# Altium project Video_Processing_Board.PrjPcb (part 1 of 2)
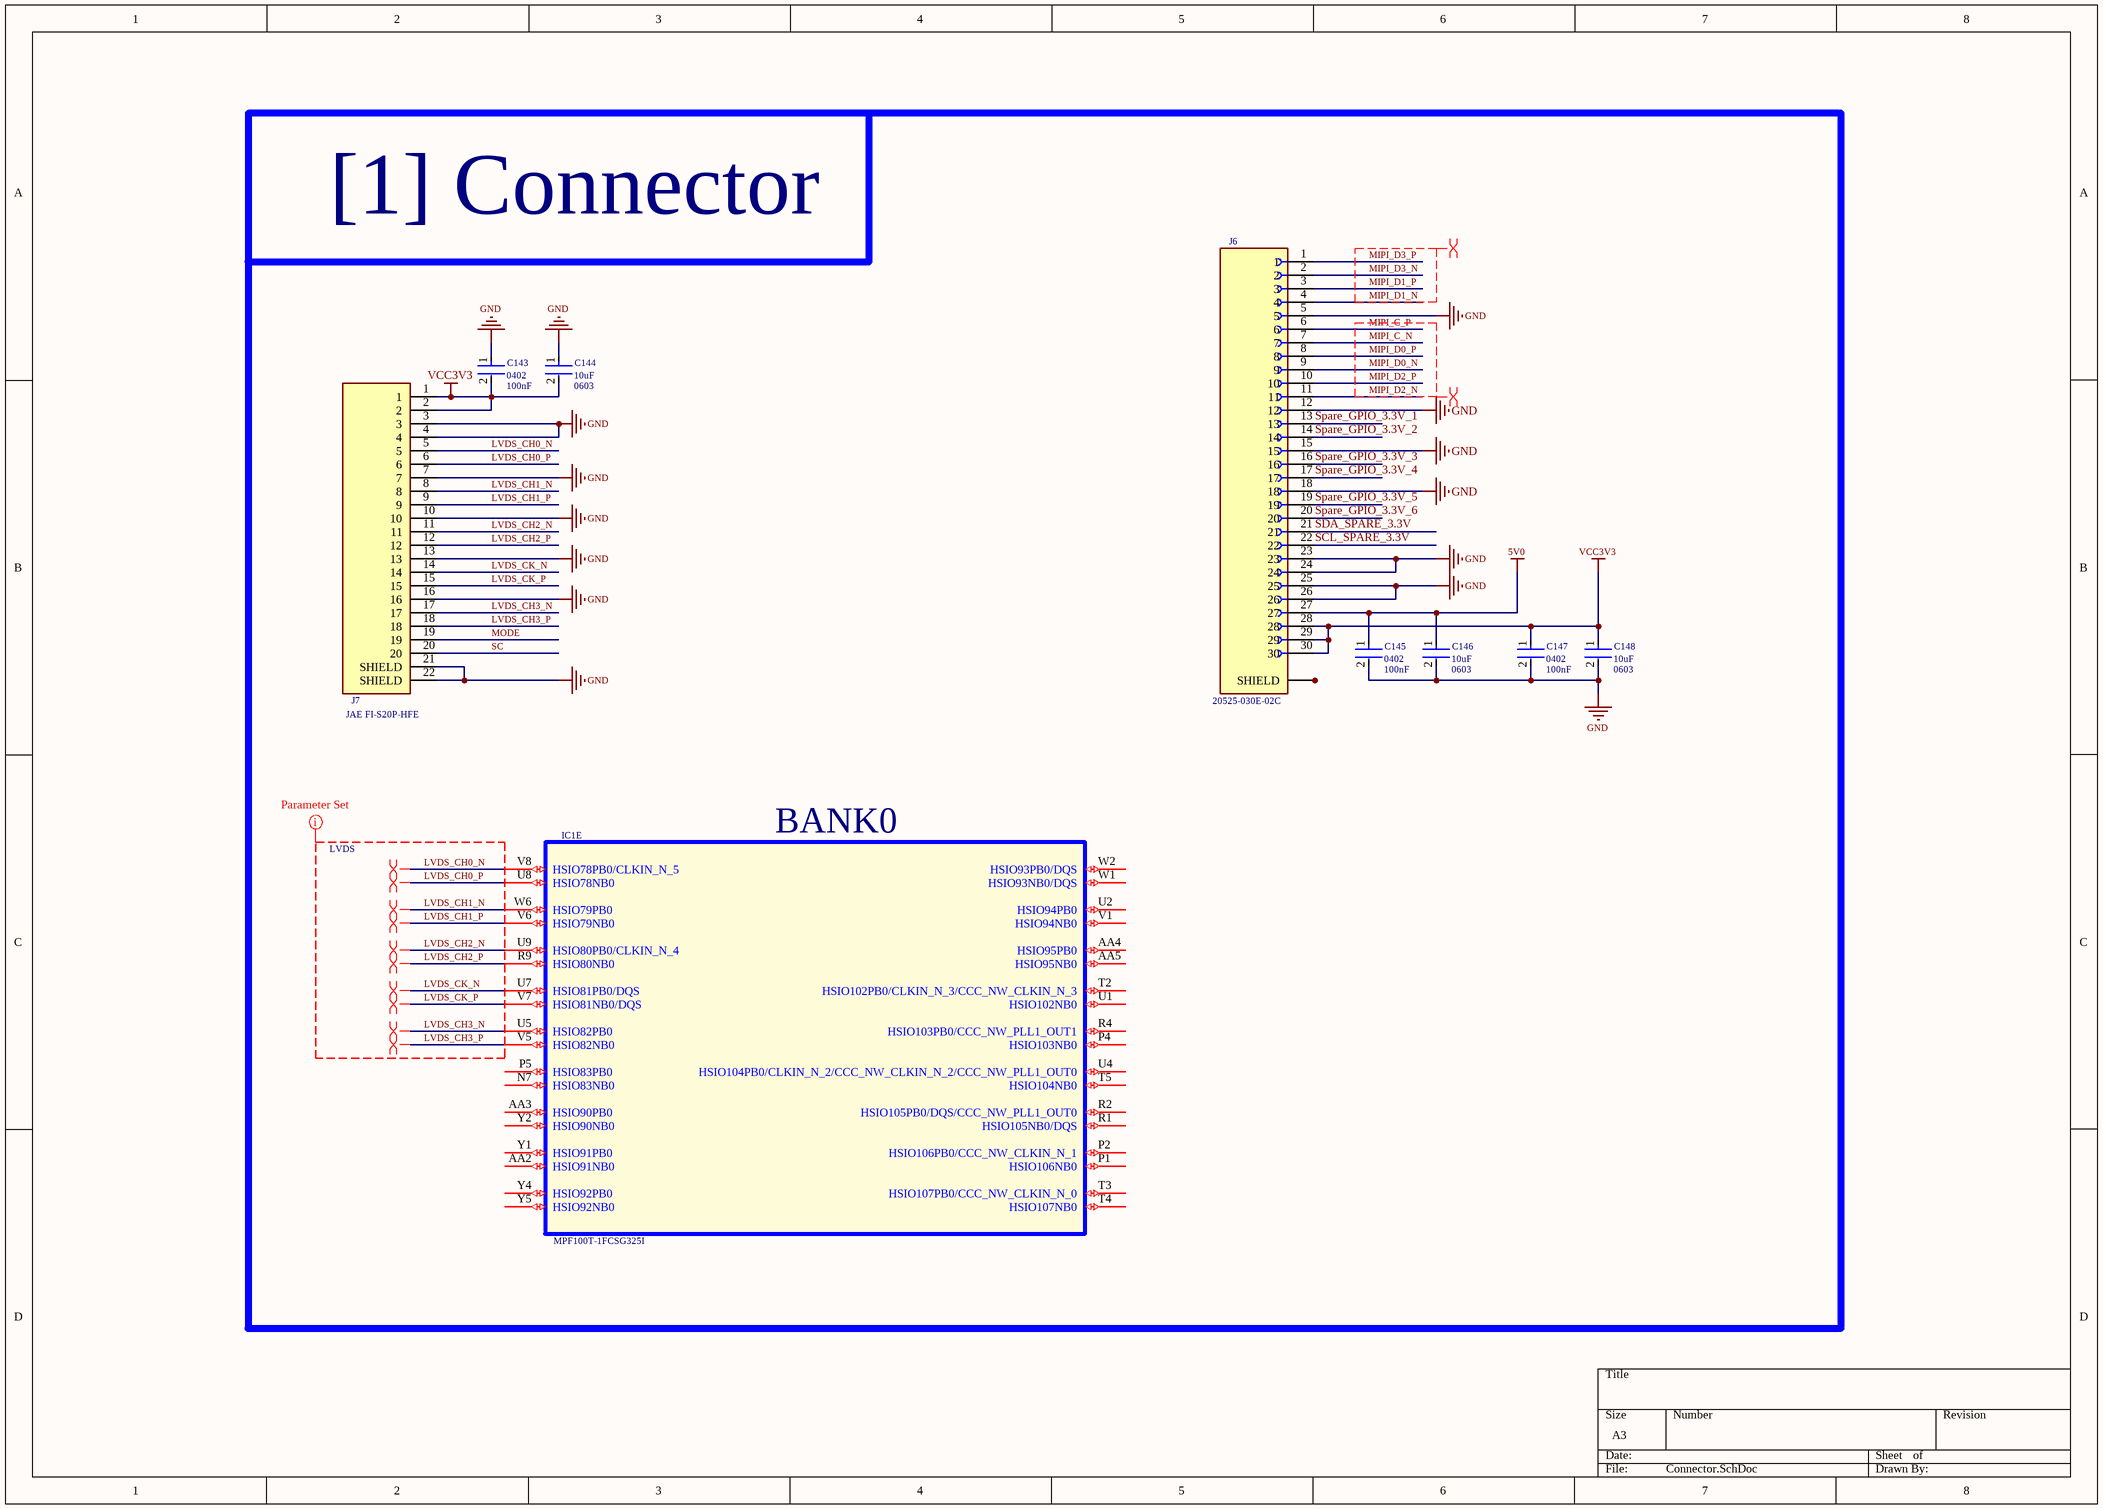
[diagram p0: Connector.SchDoc]
9 sheets, 308 parts. Net scope: global (net labels, ports and power ports of the same name join across sheets).
Board file: Video_Processing_Board.PcbDoc
Sheets:
  Connector.SchDoc
  PMIC.SchDoc
  Power and Decoupling Capacitors.SchDoc
  DRAM+BANK1.SchDoc
  Input Transceivers.SchDoc
  Output Transceivers.SchDoc
  JTAG & Reset Connection.SchDoc
  USBModule.SchDoc
  FPGA_BANKS.SchDoc

## Sheet Connector.SchDoc
size A3; SheetNumber: 1; SheetTotal: 9

### Parts
C143  Package: 0402  Capacitance: 100nF  [FP-C0402-BB-MFG]  (hidden comment: C0402C104K8PACTU)
C144  Capacitance: 10uF  Case/Package: 0603  [FP-GRM188-0_1-e0_2_0_55-IPC_A]  (hidden comment: GRM188R60J106ME47D)
C145  Package: 0402  Capacitance: 100nF  [FP-C0402-BB-MFG]  (hidden comment: C0402C104K8PACTU)
C146  Capacitance: 10uF  Case/Package: 0603  [FP-GRM188-0_1-e0_2_0_55-IPC_A]  (hidden comment: GRM188R60J106ME47D)
C147  Package: 0402  Capacitance: 100nF  [FP-C0402-BB-MFG]  (hidden comment: C0402C104K8PACTU)
C148  Capacitance: 10uF  Case/Package: 0603  [FP-GRM188-0_1-e0_2_0_55-IPC_A]  (hidden comment: GRM188R60J106ME47D)
IC1  MPF100T-1FCSG325I  [MPF100T-1FCSG325I]  (part E of 9)
J6  20525-030E-02C  [I-PEX_20525-030E-02C]
J7  JAE FI-S20P-HFE  [JAE FI-S20P-HFE]

### Blocks framed on the sheet
[1] Connector: C143-C148 IC1 J6 J7

### Nets
5V0: C145.1 C146.1 J6.27
GND: C143.1 C144.1 C145.2 C146.2 C147.2 C148.2 J6.5 J6.12 J6.15 J6.18 J6.23 J6.24 J6.25 J6.26 J7.3 J7.4 J7.7 J7.10 J7.13 J7.16 J7.21(SHIELD) J7.22(SHIELD)
VCC3V3: C143.2 C144.2 C147.1 C148.1 J6.28 J6.29 J6.30 J7.1 J7.2
LVDS_CH0_N: IC1.V8(HSIO78PB0/CLKIN_N_5) J7.5
LVDS_CH0_P: IC1.U8(HSIO78NB0) J7.6
LVDS_CH1_N: IC1.W6(HSIO79PB0) J7.8
LVDS_CH1_P: IC1.V6(HSIO79NB0) J7.9
LVDS_CH2_N: IC1.U9(HSIO80PB0/CLKIN_N_4) J7.11
LVDS_CH2_P: IC1.R9(HSIO80NB0) J7.12
LVDS_CH3_N: IC1.U5(HSIO82PB0) J7.17
LVDS_CH3_P: IC1.V5(HSIO82NB0) J7.18
LVDS_CK_N: IC1.U7(HSIO81PB0/DQS) J7.14
LVDS_CK_P: IC1.V7(HSIO81NB0/DQS) J7.15
MIPI_C_N: J6.7
MIPI_C_P: J6.6
MIPI_D0_N: J6.9
MIPI_D0_P: J6.8
MIPI_D1_N: J6.4
MIPI_D1_P: J6.3
MIPI_D2_N: J6.11
MIPI_D2_P: J6.10
MIPI_D3_N: J6.2
MIPI_D3_P: J6.1
MODE: J7.19
SC: J7.20
SCL_SPARE_3.3V: J6.22
SDA_SPARE_3.3V: J6.21
Spare_GPIO_3.3V_1: J6.13
Spare_GPIO_3.3V_2: J6.14
Spare_GPIO_3.3V_3: J6.16
Spare_GPIO_3.3V_4: J6.17
Spare_GPIO_3.3V_5: J6.19
Spare_GPIO_3.3V_6: J6.20
NetJ6_P1: J6.P1(SHIELD) J6.P2(SHIELD) J6.P3(SHIELD) J6.P4(SHIELD) J6.P5(SHIELD) J6.P6(SHIELD) J6.P7(SHIELD) J6.P8(SHIELD) J6.P9(SHIELD) J6.P10(SHIELD) J6.P11(SHIELD)

Not connected (* = marked no-connect by the designer): IC1 AA2(HSIO91NB0) AA3(HSIO90PB0) AA4(HSIO95PB0) AA5(HSIO95NB0) N7(HSIO83NB0) P1(HSIO106NB0) P2(HSIO106PB0/CCC_NW_CLKIN_N_1) P4(HSIO103NB0) P5(HSIO83PB0) R1(HSIO105NB0/DQS) R2(HSIO105PB0/DQS/CCC_NW_PLL1_OUT0) R4(HSIO103PB0/CCC_NW_PLL1_OUT1) T2(HSIO102PB0/CLKIN_N_3/CCC_NW_CLKIN_N_3) T3(HSIO107PB0/CCC_NW_CLKIN_N_0) T4(HSIO107NB0) T5(HSIO104NB0) U1(HSIO102NB0) U2(HSIO94PB0) U4(HSIO104PB0/CLKIN_N_2/CCC_NW_CLKIN_N_2/CCC_NW_PLL1_OUT0) V1(HSIO94NB0) W1(HSIO93NB0/DQS) W2(HSIO93PB0/DQS) Y1(HSIO91PB0) Y2(HSIO90NB0) Y4(HSIO92PB0) Y5(HSIO92NB0)

### Layout directives
differential pair: LVDS_CH0_N, LVDS_CH0_P, LVDS_CH1_N, LVDS_CH1_P, LVDS_CH2_N, LVDS_CH2_P, LVDS_CH3_N, LVDS_CH3_P, LVDS_CK_N, LVDS_CK_P, MIPI_C_N, MIPI_C_P, MIPI_D0_N, MIPI_D0_P, MIPI_D1_N, MIPI_D1_P, MIPI_D2_N, MIPI_D2_P, MIPI_D3_N, MIPI_D3_P
net class LVDS: LVDS_CH0_N, LVDS_CH0_P, LVDS_CH1_N, LVDS_CH1_P, LVDS_CH2_N, LVDS_CH2_P, LVDS_CH3_N, LVDS_CH3_P, LVDS_CK_N, LVDS_CK_P

### Notes on the sheet
- (in symbol MPF100T-1FCSG325I, part E) BANK0

### Library data of the parts
C143 C145 C147 = CMP-2008-02046-2: CAP CER 0.1UF 10V X5R 0402; Manufacturer: Kemet; Material: Ceramic; Temperature Coefficient: 15%; Tolerance: 0.1; Value: 0.10 μF; Temperature: -55°C to +125°C; ComponentLink2Description: Datasheet; Temperature Characteristic: X5R; Device Class L1: Passive Components; Height: 0.55mm; Lead Free: Yes; ComponentLink2URL: https://content.kemet.com/datasheets/KEM_C1002_X7R_SMD.pdf; Device Class L2: Capacitors; Temperature Range Low: -55°C; Temperature Range High: +125°C; RoHS: TRUE; Octopart: https://octopart.com/c0402c104k8pactu-kemet-140039; Automotive: No; Mouser Description: Capacitor 100 nF 10 VDC 0402; Category: Cap; Voltage Rating: 10 V; Digikey Description: CAP CER 0.1UF 10V X5R 0402; Ipc Land Pattern Name: CAPC10050X50; Device Class L3: Ceramic Capacitors; Manufacturer Part Number: C0402C104K8PACTU; Manufacturer: KEMET
C144 C146 C148 = CMP-2006-02792-2: Chip Multilayer Ceramic Capacitors for General Purpose, 0603, 10uF, X5R, 15%, 20%, 6.3V; Manufacturer: Murata; Packaging: Tape and Reel; Voltage Rating (DC): 6.3V; Width: 0.031inch; Termination: SMD/SMT; Dielectric: X5R; Package Quantity: 4000; Voltage Rating: 6.3V; Min Operating Temperature: -55°C; Voltage: 6.3V; Length: 1.6mm; Thickness: 0.035inch; Lead Free: Lead Free; Depth: 0.8mm; Case Code (Imperial): 0603; Max Operating Temperature: 85°C; Material: Ceramic; Height: 0.8mm; Tolerance: 20%; Mount: Surface Mount; REACH SVHC: No SVHC; Radiation Hardening: No; Case Code (Metric): 1608; Manufacturer Part Number: GRM188R60J106ME47D
IC1 = MPF100T-1FCSG325I: Part_Number: J00001; Part_Name: Jumper; ID: 110; Mounting_Type: SMT; ComponentLink1Description: Datasheet
J6 = 20525-030E-02C: 0.4 mm pitch, Horizontal mating Micro-coaxial cable connector; MF: I-PEX; SnapEDA_Link: https://www.snapeda.com/parts/20525-030E-02C/I-PEX/view-part/?ref=snap; Availability: Not in stock; Package: Package; Check_prices: https://www.snapeda.com/parts/20525-030E-02C/I-PEX/view-part/?ref=eda; Value: *; Price: None; MP: 20525-030E-02C
J7 = JAE FI-S20P-HFE: Board-to-Cable Connector, Friction lock, connector, Standard type , 20 pos., 1.25mm pitch, Board side receptacle; Part_Number: J00001; Part_Name: Jumper; ID: 110; Mounting_Type: SMT; ComponentLink1Description: Datasheet

## Sheet PMIC.SchDoc
size A3; SheetNumber: 2; SheetTotal: 9; SPICEModelCacheDPLPYRRR: <root> / <DocumentId>DPLPYRRR</DocumentId> / <CacheFrame Number="0"> / <Model Name="emk105bj105_v-f" Kind="CKT"> / <Text>* EMK105BJ105_V-F     SPICE MODEL  ( General Type ) / *-------------------------------------------------------------------------------------------------------- / * Model Generated by TAIYO YUDEN Corporation (http://www.ty-top.com) / * Version 1.0 / * TAIYO YUDEN Control No. 170508_130520 / * Copyright(c) 2012 TAIYO YUDEN CO.,LTD. All Rights Reserved. / *-------------------------------------------------------------------------------------------------------- / * / * Products Name : Multilayer Ceramic Capacitors / * / * Characteristics : / *     Capacitance : 1 uF , Rated Voltage : 16V , TCC : X5R / *     Case Size : 1.0 x 0.5 / 0.039 x 0.02 [mm/inch] , Thickness : 0.5 / 0.02 [mm/inch] / *     (Conditions: Temperature = 25 degC , DC Bias Current/Voltage = 0A / 0V) / * / * Frequency Range : 40Hz - 3GHz / * / * External Node Assignments : / * / *  1  o---| |---o  2 / * / *-------------------------------------------------------------------------------------------------------- / .SubCkt EMK105BJ105_V-F 1 2 / **************************** / C0 1 110 0.68309u / Cm 1 101 0.26053u / C1 101 102 0.94076u / Rc1 101 102 1.9029k / C2 102 103 0.66707u / Rc2 102 103 120.36 / C3 103 110 0.57203u / Rc3 103 110 2.1097 / C2m 1 301 0.1871u / C21 301 302 3.2494u / Rc21 301 302 1.1117k / C22 302 303 2.1014u / Rc22 302 303 1.484k / C23 303 304 2.1172u / Rc23 303 304 1.3876k / C24 304 305 0.75729u / Rc24 304 305 332.59 / C25 305 306 0.94401u / Rc25 305 306 249.09 / C26 306 307 0.34674u / Rc26 306 307 28.352 / C27 307 308 0.37158u / Rc27 307 308 19.989 / C28 308 309 0.17933u / Rc28 308 309 31.748 / C29 309 110 0.016445u / Rc29 309 110 1.0592 / Rp0 1 110 100Meg / L0 110 120 0.2216n / Lm 120 130 0.1509n / L1 120 121 0.12659n / RL1 121 130 0.85161 / L2 120 122 0.15996n / RL2 122 130 0.42469 / L3 120 123 7.9543n / RL3 123 130 0.54643m / CR 120 124 0.24334u / LR 124 125 0.090738n / RR 125 130 68.076m / CL 130 140 2.7354p / LL 130 140 0.10762n / RL 130 140 50.614 / Rs 140 2 7.5416m / **************************** / .ends EMK105BJ105_V-F</Text> / </Model> / </CacheFrame> / </root>
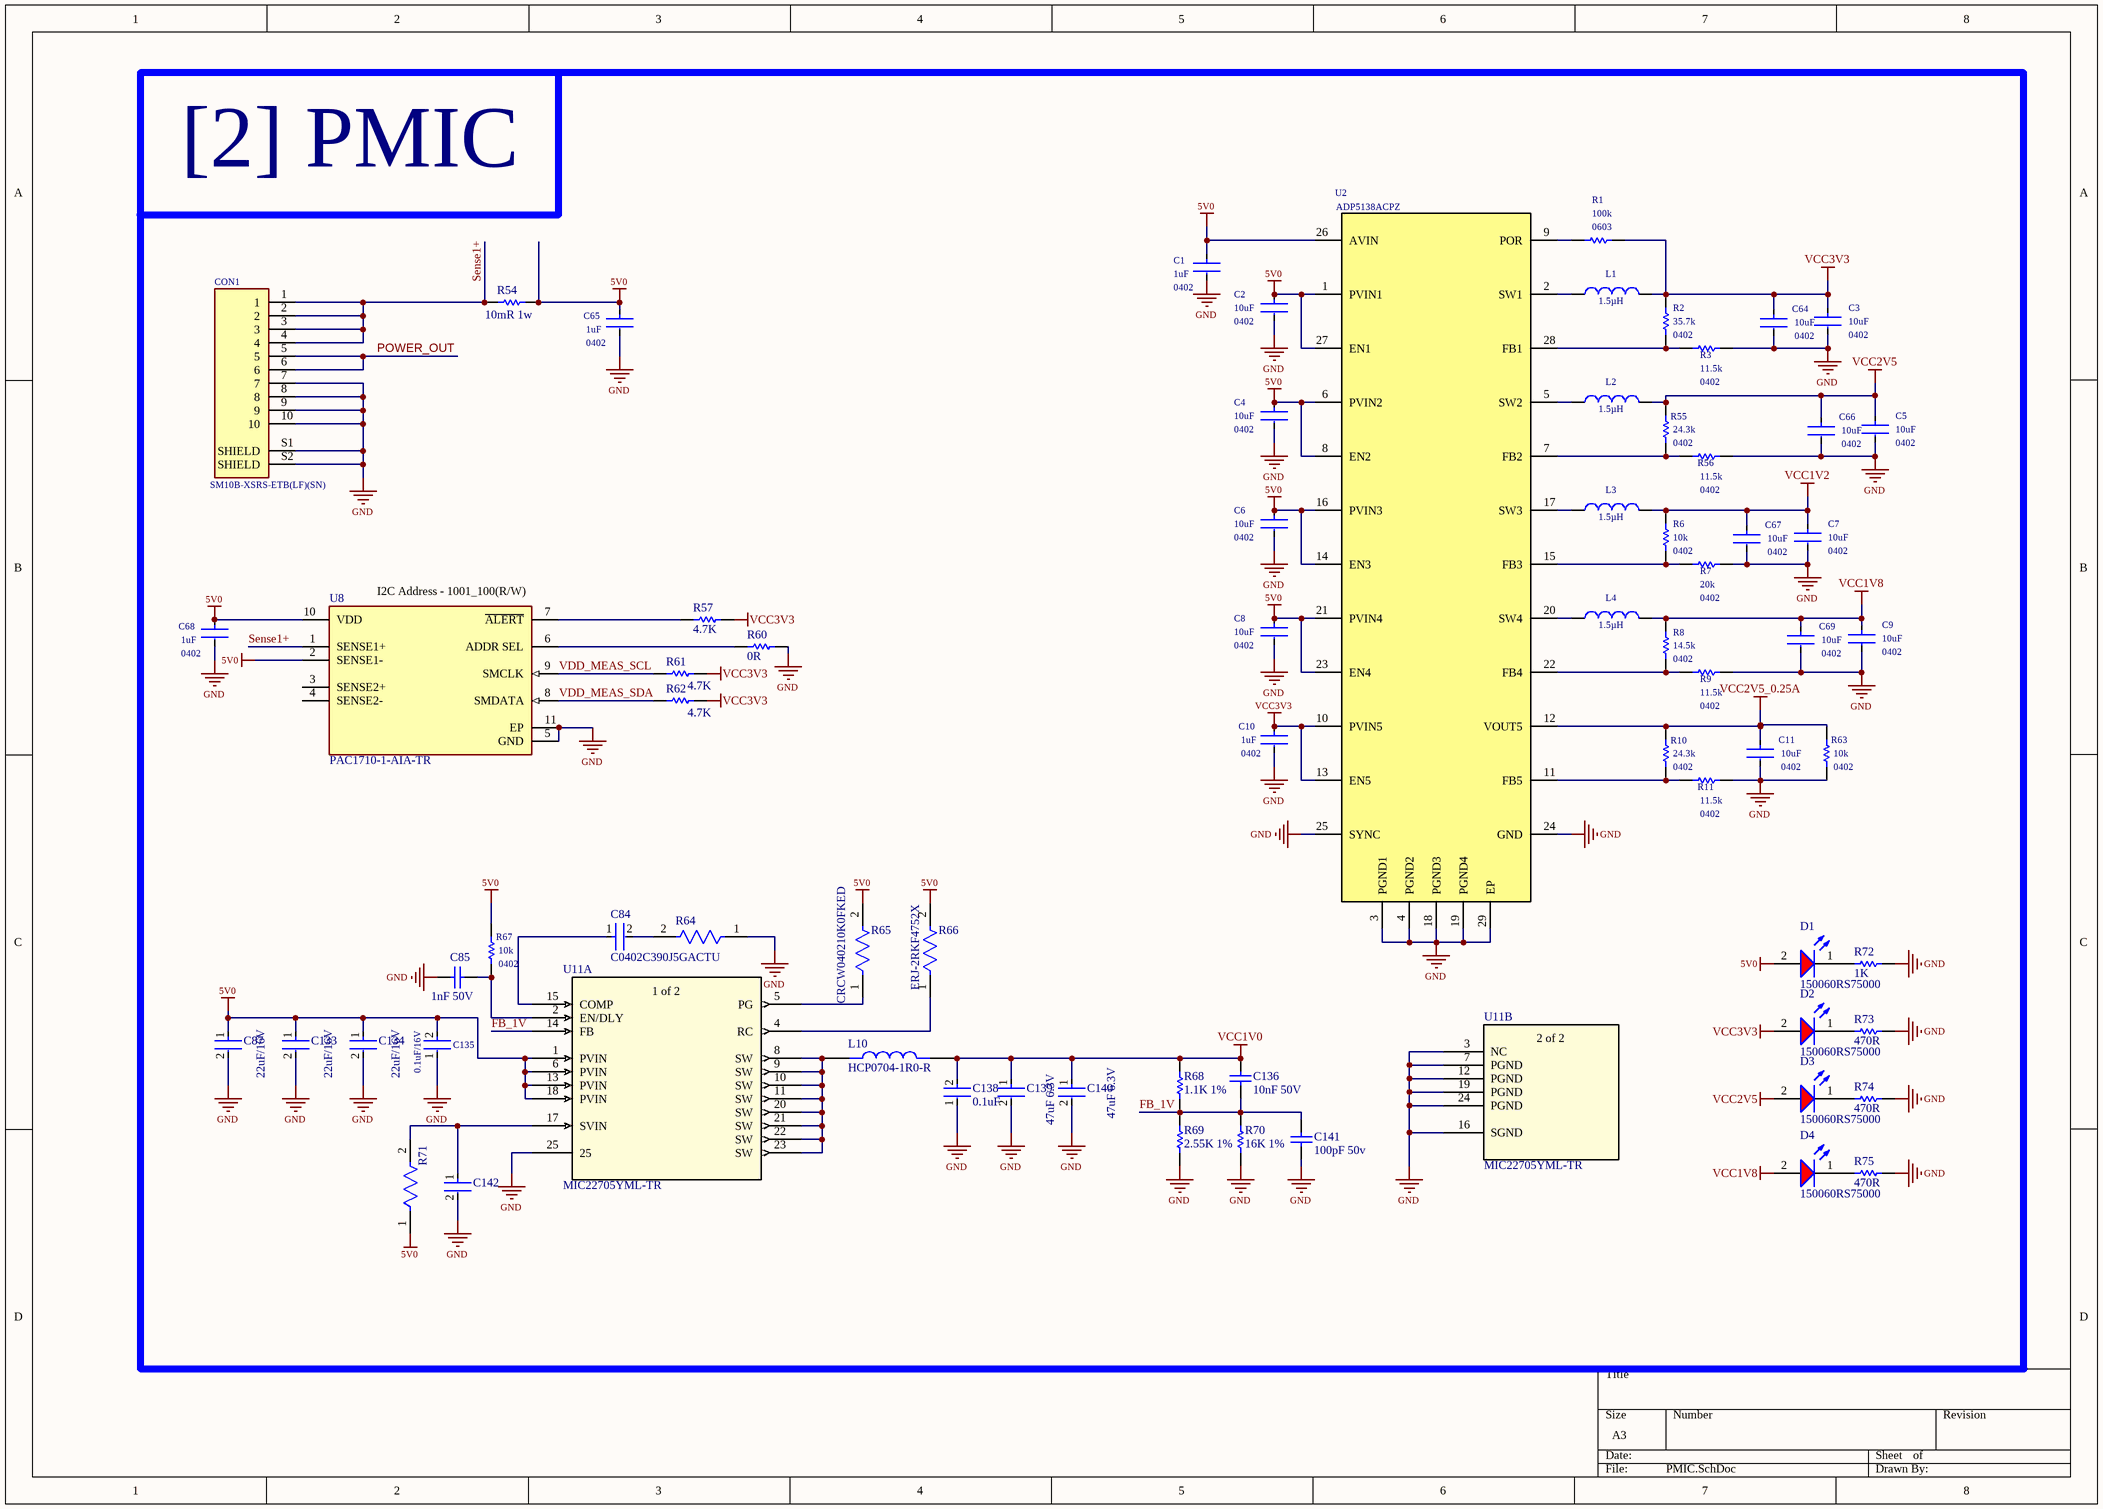
[diagram p1: PMIC.SchDoc]

### Parts
C1  Case/Package: 0402  Capacitance: 1uF  [FP-0402-L_1_0_0_05-W_0_5-IPC_A]  (hidden comment: EMK105BJ105KV-F)
C2  Case/Package: 0402  Capacitance: 10uF  [FP-GRM155-0_2-IPC_B]  (hidden comment: GRM155R60J106ME44D)
C3  Case/Package: 0402  Capacitance: 10uF  [FP-GRM155-0_2-IPC_B]  (hidden comment: GRM155R60J106ME44D)
C4  Case/Package: 0402  Capacitance: 10uF  [FP-GRM155-0_2-IPC_B]  (hidden comment: GRM155R60J106ME44D)
C5  Case/Package: 0402  Capacitance: 10uF  [FP-GRM155-0_2-IPC_B]  (hidden comment: GRM155R60J106ME44D)
C6  Case/Package: 0402  Capacitance: 10uF  [FP-GRM155-0_2-IPC_B]  (hidden comment: GRM155R60J106ME44D)
C7  Case/Package: 0402  Capacitance: 10uF  [FP-GRM155-0_2-IPC_B]  (hidden comment: GRM155R60J106ME44D)
C8  Case/Package: 0402  Capacitance: 10uF  [FP-GRM155-0_2-IPC_B]  (hidden comment: GRM155R60J106ME44D)
C9  Case/Package: 0402  Capacitance: 10uF  [FP-GRM155-0_2-IPC_B]  (hidden comment: GRM155R60J106ME44D)
C10  Case/Package: 0402  Capacitance: 1uF  [FP-0402-L_1_0_0_05-W_0_5-IPC_A]  (hidden comment: EMK105BJ105KV-F)
C11  Case/Package: 0402  Capacitance: 10uF  [FP-GRM155-0_2-IPC_B]  (hidden comment: GRM155R60J106ME44D)
C64  Case/Package: 0402  Capacitance: 10uF  [FP-GRM155-0_2-IPC_B]  (hidden comment: GRM155R60J106ME44D)
C65  Case/Package: 0402  Capacitance: 1uF  [FP-0402-L_1_0_0_05-W_0_5-IPC_A]  (hidden comment: EMK105BJ105KV-F)
C66  Case/Package: 0402  Capacitance: 10uF  [FP-GRM155-0_2-IPC_B]  (hidden comment: GRM155R60J106ME44D)
C67  Case/Package: 0402  Capacitance: 10uF  [FP-GRM155-0_2-IPC_B]  (hidden comment: GRM155R60J106ME44D)
C68  Case/Package: 0402  Capacitance: 1uF  [FP-0402-L_1_0_0_05-W_0_5-IPC_A]  (hidden comment: EMK105BJ105KV-F)
C69  Case/Package: 0402  Capacitance: 10uF  [FP-GRM155-0_2-IPC_B]  (hidden comment: GRM155R60J106ME44D)
C84  C0402C390J5GACTU  [FP-C0402-BB-MFG]
C85  1nF 50V  [CAPC1005X55X25ML5T10]
C87  22uF/16V  [FP-0805-L_2_0_0_2-W_1_25-IPC_A]
C133  22uF/16V  [FP-0805-L_2_0_0_2-W_1_25-IPC_A]
C134  22uF/16V  [FP-0805-L_2_0_0_2-W_1_25-IPC_A]
C135  0.1uF/16V  [FP-GRM15-MFG]
C136  10nF 50V  [CAPC1005X55X30LL05T10]
C138  0.1uF  [FP-GRM15-MFG]
C139  47uF 6.3V  [FP-C0805C476M9PACTU-MFG]
C140  47uF 6.3V  [FP-C0805C476M9PACTU-MFG]
C141  100pF 50v  [CAPC1005X55X25ML05T10]
C142  C1005X5R1C225K050BC  [FP-C1005-050-0_05-IPC_A]  (value not drawn)
CON1  SM10B-XSRS-ETB(LF)(SN)  [SM10B-XSRS-ETB]
D1  150060RS75000  [WL-SMCW_0603_150060xx75000]
D2  150060RS75000  [WL-SMCW_0603_150060xx75000]
D3  150060RS75000  [WL-SMCW_0603_150060xx75000]
D4  150060RS75000  [WL-SMCW_0603_150060xx75000]
L1  Inductance: 1.5µH  [WE-TPC-3816-S]  (hidden comment: 744031001)
L2  Inductance: 1.5µH  [WE-TPC-3816-S]  (hidden comment: 744031001)
L3  Inductance: 1.5µH  [WE-TPC-3816-S]  (hidden comment: 744031001)
L4  Inductance: 1.5µH  [WE-TPC-3816-S]  (hidden comment: 744031001)
L10  HCP0704-1R0-R  [IND_SCIHP1367-100M]
R1  value 100k  Package: 0603  [RESC1608X55X30ML20T20]  (hidden comment: ERA3AEB104V)
R2  Parameter 1: 35.7k  Parameter 2: 0402  [RESC1005X40X25NL05T10]  (hidden comment: RC0402FR-0735K7L)
R3  Parameter 3: 11.5k  Parameter 4: 0402  [RESC1005X40X25NL05T10]  (hidden comment: RC0402FR-0711K5L)
R6  Parameter 3: 10k  Parameter 4: 0402  [RESC1005X40X25NL05T10]  (hidden comment: RC0402FR-0710KL)
R7  Parameter 3: 20k  Parameter 4: 0402  [RESC1005X40X25NL05T10]  (hidden comment: RC0402FR-0720KL)
R8  Parameter 3: 14.5k  Parameter 4: 0402  [RESC1005X40N]  (hidden comment: RN73H1ETTP1452F25)
R9  Parameter 3: 11.5k  Parameter 4: 0402  [RESC1005X40X25NL05T10]  (hidden comment: RC0402FR-0711K5L)
R10  Parameter 3: 24.3k  Parameter 4: 0402  [RESC1005X40X25NL05T10]  (hidden comment: RC0402FR-0724K3L)
R11  Parameter 3: 11.5k  Parameter 4: 0402  [RESC1005X40X25NL05T10]  (hidden comment: RC0402FR-0711K5L)
R54  10mR 1w  [RESC2013X50X30LL20T20]
R55  Parameter 3: 24.3k  Parameter 4: 0402  [RESC1005X40X25NL05T10]  (hidden comment: RC0402FR-0724K3L)
R56  Parameter 3: 11.5k  Parameter 4: 0402  [RESC1005X40X25NL05T10]  (hidden comment: RC0402FR-0711K5L)
R57  4.7K  [RESC1005X40X25LL05T05]
R60  0R  [RESC1608X55X25ML10T15]
R61  4.7K  [RESC1005X40X25LL05T05]
R62  4.7K  [RESC1005X40X25LL05T05]
R63  Parameter 3: 10k  Parameter 4: 0402  [RESC1005X40X25NL05T10]  (hidden comment: RC0402FR-0710KL)
R64  CRCW040220K0FKED  [FP-CRCW0402-e3-IPC_B]  (value not drawn)
R65  CRCW040210K0FKED  [FP-CRCW0402-e3-IPC_B]
R66  ERJ-2RKF4752X  [FP-ERJ2RK-IPC_A]
R67  Parameter 3: 10k  Parameter 4: 0402  [RESC1005X40X25NL05T10]  (hidden comment: RC0402FR-0710KL)
R68  1.1K 1%  [RESC0603X26X15ML03T05]
R69  2.55K 1%  [RESC2013X60X40NL20T25]
R70  16K 1%  [RESC1005X40X25ML05T10]
R71  CRCW04022R20FKED  [FP-CRCW0402-e3-IPC_C]  (value not drawn)
R72  1K  [RESC1005X40X25ML05T10]
R73  470R  [RESC1005X40X25ML05T10]
R74  470R  [RESC1005X40X25ML05T10]
R75  470R  [RESC1005X40X25ML05T10]
U2  ADP5138ACPZ  [CP_28_5]
U8  PAC1710-1-AIA-TR  [FP-C04-206-MFG]
U11  MIC22705YML-TR  [MLF-24_ML_MCH]  (parts A,B of 2)

### Nets
5V0: C1.1 C2.1 C4.1 C6.1 C8.1 C65.1 C68.1 C87.1 C133.1 C134.1 C135.2 D1.2(A) R54.2 R65.2 R66.2 R67.2 R71.1 U2.1(PVIN1) U2.6(PVIN2) U2.8(EN2) U2.14(EN3) U2.16(PVIN3) U2.21(PVIN4) U2.23(EN4) U2.26(AVIN) U2.27(EN1) U8.2(SENSE1-) U8.10(VDD) U11.1(PVIN) U11.6(PVIN) U11.13(PVIN) U11.18(PVIN)
GND: C1.2 C2.2 C3.2 C4.2 C5.2 C6.2 C7.2 C8.2 C9.2 C10.2 C11.2 C64.2 C65.2 C66.2 C67.2 C68.2 C69.2 C85.1 C87.2 C133.2 C134.2 C135.1 C138.1 C139.2 C140.2 C141.1 C142.2 CON1.7 CON1.8 CON1.9 CON1.10 CON1.S1(SHIELD) CON1.S2(SHIELD) R3.2 R7.2 R9.2 R11.2 R56.2 R60.2 R63.1 R64.1 R69.1 R70.1 R72.2 R73.2 R74.2 R75.2 U2.3(PGND1) U2.4(PGND2) U2.18(PGND3) U2.19(PGND4) U2.24(GND) U2.25(SYNC) U2.29(EP) U8.5(GND) U8.11(EP) U11.3(NC) U11.7(PGND) U11.12(PGND) U11.16(SGND) U11.19(PGND) U11.24(PGND) U11.25
VCC1V0: C136.2 C138.2 C139.1 C140.1 L10.2 R68.2
VCC1V2: C7.1 C67.1 L3.2 R6.2
VCC1V8: C9.1 C69.1 D4.2(A) L4.2 R8.2
VCC2V5: C5.1 C66.1 D3.2(A) L2.2 R55.2
VCC2V5_0.25A: C11.1 R10.2 R63.2 U2.12(VOUT5)
VCC3V3: C3.1 C10.1 C64.1 D2.2(A) L1.2 R1.2 R2.2 R57.2 R61.2 R62.2 U2.10(PVIN5) U2.13(EN5)
FB_1V: C136.1 C141.2 R68.1 R69.2 R70.2 U11.14(FB)
POWER_OUT: CON1.5 CON1.6
Sense1+: CON1.1 CON1.2 CON1.3 CON1.4 R54.1 U8.1(SENSE1+)
VDD_MEAS_SCL: R61.1 U8.9(SMCLK)
VDD_MEAS_SDA: R62.1 U8.8(SMDATA)
NetC84_1: C84.1 U11.15(COMP)
NetC84_2: C84.2 R64.2
NetC85_2: C85.2 R67.1 U11.2(EN/DLY)
NetC142_1: C142.1 R71.2 U11.17(SVIN)
NetD1_1: D1.1(K) R72.1
NetD2_1: D2.1(K) R73.1
NetD3_1: D3.1(K) R74.1
NetD4_1: D4.1(K) R75.1
NetL1_1: L1.1 U2.2(SW1)
NetL2_1: L2.1 U2.5(SW2)
NetL3_1: L3.1 U2.17(SW3)
NetL4_1: L4.1 U2.20(SW4)
NetL10_1: L10.1 U11.8(SW) U11.9(SW) U11.10(SW) U11.11(SW) U11.20(SW) U11.21(SW) U11.22(SW) U11.23(SW)
NetR1_1: R1.1 U2.9(POR)
NetR2_1: R2.1 R3.1 U2.28(FB1)
NetR6_1: R6.1 R7.1 U2.15(FB3)
NetR8_1: R8.1 R9.1 U2.22(FB4)
NetR10_1: R10.1 R11.1 U2.11(FB5)
NetR55_1: R55.1 R56.1 U2.7(FB2)
NetR57_1: R57.1 U8.7(~{ALERT})
NetR60_1: R60.1 U8.6(ADDR_SEL)
NetR65_1: R65.1 U11.5(PG)
NetR66_1: R66.1 U11.4(RC)

Not connected (* = marked no-connect by the designer): U8 3(SENSE2+) 4(SENSE2-)

### Notes on the sheet
- [2] PMIC
- (near U8) I2C Address - 1001_100(R/W)
- (in symbol MIC22705YML-TR, part A) 1 of 2
- (in symbol MIC22705YML-TR, part B) 2 of 2

### Library data of the parts
C1 C10 C65 C68 = CMP-14477-000104-2: None; Tolerance: 10%; Voltage Rating: 16V; Dielectric: X5R; Packaging: Tape and Reel; Depth: 0.5mm; Mount: Surface Mount; Thickness: 0.022inch; Package Quantity: 1; Min Operating Temperature: -55°C; Series: M; Voltage Rating (DC): 16V; Termination: SMD/SMT; Number of Pins: 2; Case Code (Imperial): 0402; Length: 1mm; Halogen Free: Halogen Free; Case Code (Metric): 1005; Width: 0.02inch; RoHS Compliant: Yes; Radiation Hardening: No; Max Operating Temperature: 85°C; Height: 0.5mm; Construction: Flat
C2-C9 C11 C64 C66 C67 C69 = CMP-2000-05265-2: CAP CER 10UF 6.3V X5R 0402; Tolerance: 20%; Voltage Rating: 6.3V; Voltage Rating (DC): 6.3V; Voltage: 6.3V; Case Code (Metric): 1005; REACH SVHC: No SVHC; Min Operating Temperature: -55°C; Height: 0.5mm; Dielectric: X5R; Depth: 0.5mm; Thickness: 0.022inch; Packaging: Tape and Reel; Length: 1mm; Mount: Surface Mount; Package Quantity: 10000; Lead Free: Lead Free; Termination: SMD/SMT; Max Operating Temperature: 85°C; Case Code (Imperial): 0402; Series: GRM; Width: 0.5mm; RoHS Compliant: Yes
C84 = CMP-2008-03289-2: CAP CER 39PF 50V C0G/NP0 0402; Manufacturer: Kemet; Temperature Coefficient: 15%; Material: Ceramic; Tolerance: 0.05; Temperature Characteristic: C0G; Temperature: -55°C to +125°C; Automotive: No; Device Class L2: Capacitors; Ipc Land Pattern Name: CAPC10050X50; Lead Free: Yes; Value: 39 pF; Category: Cap; Manufacturer Part Number: C0402C390J5GACTU; ComponentLink2URL: https://content.kemet.com/datasheets/KEM_C1002_X7R_SMD.pdf; Mouser Description: Multilayer Ceramic Capacitors MLCC - SMD/SMT 50volts 39pF C0G 5%; Octopart: https://octopart.com/c0402c390j5gactu-kemet-121734; Temperature Range High: +125°C; Package: C0402-BB; Height: 0.55mm; Capacitance: 39 pF; RoHS: TRUE; Voltage Rating: 50 V; Device Class L1: Passive Components; Device Class L3: Ceramic Capacitors; Temperature Range Low: -55°C; Digikey Description: CAP CER 39PF 50V C0G/NP0 0402; ComponentLink2Description: Datasheet
C85 = CMP-1662-00017-1: Chip Capacitor, 1 nF, +/- 10%, 50 V, -55 to 125 degC, 0402 (1005 Metric), RoHS, Tape and Reel; Case\/Package: 0402; Type (Capacitors): X7R; Width: 0.5 mm; Pins: 2; REACH SVHC: No SVHC; Length: 1 mm; Height: 0.5 mm; PackageDescription: 2-Pin Surface Mount Device, Body 1 x 0.5 mm; DatasheetVersion: 07/2016; Mount: Surface Mount; ComponentLink2Description: Datasheet; Tolerance: 10%; ComponentLink2URL: http://psearch.en.murata.com/capacitor/product/GRM155R71H102KA01%23.pdf; ComponentLink1URL: http://www.murata.com/; Case Code (Metric): 1005; Voltage Rating (DC): 50 V; Package Quantity: 10000; Min Operating Temperature: -55 degC; Max Operating Temperature: 125 degC; Capacitance: 1 nF; Voltage Rating: 50 V; ComponentLink1Description: Manufacturer URL; Packaging: Tape and Reel; Radiation Hardening: No; RoHSCompliant: true; PackageReference: 0402; Mounting Technology: Surface Mount; Case Code (Imperial): 0402
C87 C133 C134 = CMP-14477-000140-3: Multilayer Ceramic Capacitor 22uF 16V X5R 20% SMD 0805 T/R; Resistor Type: Ceramic; Packaging: Tape and Reel; Height: 1.25mm; RoHS Compliant: Yes; Case Code (Metric): 2012; Series: M; Dielectric: X5R; Max Operating Temperature: 85°C; Voltage Rating: 16V; Width: 0.039inch; Capacitance: 22uF; Min Operating Temperature: -55°C; Thickness: 0.049inch; Termination: SMD/SMT; Construction: Flat; Voltage Rating (DC): 16V; Package Quantity: 1; Tolerance: 20%; Case Code (Imperial): 0805; Length: 2mm; Mount: Surface Mount; Halogen Free: Halogen Free; Case/Package: 0805
C135 C138 = CMP-2100-03641-2: CAP CER 0.1UF 16V X7R 0402; Manufacturer Part Number: GRM155R71C104KA88D; Manufacturer: Murata; Standoff Height: 0mm; Tolerance: 10%; Voltage Rating: 16Vdc; Material: Ceramic; Capacitance: 0.10μF; Value: 0.10μF; RoHS: TRUE; Temperature Characteristic: X7R; Octopart: https://octopart.com/grm155r71c104ka88d-murata-196880; Digikey Description: CAP CER 0.1UF 16V X7R 0402; Device Class L3: Ceramic Capacitors; Height: 0.55mm; ComponentLink2Description: Datasheet; Temperature Range Low: -55°C; Ipc Land Pattern Name: CAPC10050X219; ComponentLink2URL: https://search.murata.co.jp/Ceramy/image/img/A01X/G101/ENG/GRM155R71H471KA01-01A.pdf; Device Class L1: Passive Components; Lead Free: yes; Category: Cap; Package: GRM15; Temperature: -55°C to +125°C; Device Class L2: Capacitors; Temperature Range High: +125°C; Mouser Description: 0402 0.1 uF 16V ±10 % Tolerance X7R SMT Multilayer Ceramic Capacitor
C136 = CMP-1034-01886-2: Part Number: C0402C103K5RACTU; Manufacturer: Kemet
C139 C140 = CMP-2007-01008-2: CAP CER 47UF 6.3V X5R 0805; Dielectric Material: Ceramic; Dissipation Factor: 5%; Tolerance: 20%; Case Code (Imperial): 0805; Mount: PCB; Width: 1.2mm; Package Quantity: 3000; Radiation Hardening: No; Packaging: Tape and Reel; Termination: SMD/SMT; Series: C0805C; Voltage: 6.3V; Depth: 1.25mm; Dielectric: X5R; Case Code (Metric): 2012; Length: 2mm; Case/Package: 0805; REACH SVHC: No SVHC; Voltage Rating (DC): 6.3V; Capacitance: 47uF; RoHS Compliant: Yes; Height: 1.25mm; Construction: Flat; Number of Pins: 2; Voltage Rating: 6.3V; Max Operating Temperature: 85°C; Min Operating Temperature: -55°C
C141 = CMP-2008-03915-1: Manufacturer: Murata; Part Number: GRM1555C1H101JA01D
C142 = CMP-2000-05998-2: Multilayer Ceramic Capacitors 2.2μF ±10% 16V X5R SMD 0402; Capacitance: 2.2uF; REACH SVHC: No SVHC; Series: C; Termination: SMD/SMT; Case Code (Imperial): 0402; Depth: 0.5mm; Mount: Surface Mount; Width: 0.02inch; Package Quantity: 1; Dielectric Material: Ceramic; Length: 1mm; Packaging: Tape and Reel; Case Code (Metric): 1005; RoHS Compliant: Yes; Dielectric: X5R; Max Operating Temperature: 85°C; Lead Free: Lead Free; Weight: 2.3E-05oz; Thickness: 0.022inch; Voltage Rating (DC): 16V; Tolerance: 10%; Voltage Rating: 16V; Resistor Type: Ceramic; Height: 0.5mm; Case/Package: 0402; Min Operating Temperature: -55°C
CON1 = SM10B-XSRS-ETB(LF)(SN): Part_Number: J00001; Part_Name: Jumper; ID: 110; Mounting_Type: SMT; ComponentLink1Description: Datasheet
D1-D4 = CMP-1426-00001-4: LED Low-Power Uni-Color Red 630nm 2V 2-Pin Chip 0603(1608Metric) T/R; Max Junction Temperature (Tj): 95°C; Dominant Wavelength: 625nm; Lens Style: Clear, Rectangular; Viewing Angle: 140°; Forward Current: 100mA; Max Reverse Voltage (DC): 5V; Luminous Intensity: 250mcd; Test Current: 20mA; Power Dissipation: 72mW; Max Operating Temperature: 85°C; Mount: Surface Mount; Height: 700µm; Packaging: Tape and Reel; REACH SVHC: Unknown; Case Code (Metric): 1608; Peak Wavelength: 630nm; Forward Voltage: 2V; Case/Package: 0603; Color: Red; RoHS: Compliant; Width: 800µm; Reverse Voltage: 5V; Min Operating Temperature: -40°C; Wavelength: 625nm; Case Code (Imperial): 0603; Length: 1.6mm
L1-L4 = CMP-0227-00364-1: SMD Shielded Tiny Power Inductor WE-TPC, L = 1.50 µH; PackageVersion: 2009; ComponentLink2Description: Datasheet; ComponentLink1URL: http://www.we-online.com; PackageDescription: SMD Inductor, 2-Leads, Body 3.8 x 3.8 mm; ComponentLink2URL: http://www.we-online.de/katalog/media/pdf/744031001.pdf; ComponentLink1Description: Manufacturer Link; DatasheetVersion: ver 6, Jan-2009; PackageReference: WE-TPC-3816-S
L10 = SCIHP1367-3R3M: MF: Signal Transformer; Package: Nonstandard Signal Transformers; Availability: Warning; Value: *; MP: SCIHP1367-3R3M; DigiKey-Purchase-URL: https://snapeda.com/shop?store=DigiKey&id=1548958; SnapEDA_Link: https://www.snapeda.com/parts/SCIHP1367-3R3M/Signal%20Transformer/view-part/1548958/?ref=snap; Price: None; L?: HCP0704-1R0-R
R1 = CMP-2000-00875-1: Manufacturer: Panasonic; Part Number: ERA3AEB104V
R2 = CMP-1011-00684-2: Manufacturer: Yageo / Phycomp; Part Number: RC0402FR-0735K7L
R3 R9 R11 R56 = CMP-2002-07364-1: Manufacturer: Yageo / Phycomp; Part Number: RC0402FR-0711K5L
R6 R63 R67 = CMP-2002-07353-1: Manufacturer: Yageo / Phycomp; Part Number: RC0402FR-0710KL
R7 = CMP-2002-07501-1: Manufacturer: Yageo / Phycomp; Part Number: RC0402FR-0720KL
R10 R55 = CMP-2002-07533-1: Manufacturer: Yageo; Part Number: RC0402FR-0724K3L
R54 = CMP-2001-04896-1: Manufacturer: Vishay Dale; Part Number: CRCW08050000Z0EA
R57 R61 R62 = CMP-2002-01154-4: Chip Resistor, 4.7 KOhm, +/- 1%, 0.1 W, -55 to 155 degC, 0402 (1005 Metric), RoHS, Tape and Reel; PartNumber: ERJ-2RKF4701X; Voltage Rating: 50 V; Case\/Package: 0402; Power Rating: 100 mW; Height: 0.35 mm; Mounting Technology: Surface Mount; REACH SVHC: Yes; Resistance: 4.7 KOhm; Max Operating Temperature: 155 degC; ComponentLink1Description: Manufacturer URL; ComponentLink2Description: Datasheet; Pins: 2; PackageReference: 0402; Tolerance: 1%; Case Code (Imperial): 0402; Length: 1 mm; PackageDescription: 2-Pin Surface Mount Device, Body 1 x 0.5 mm; RoHSCompliant: true; Package Quantity: 1; Radiation Hardening: No; DatasheetVersion: 04/2015; Width: 0.5 mm; Case Code (Metric): 1005; Mount: Surface Mount; ComponentLink1URL: http://www.panasonic.com/; Min Operating Temperature: -55 degC; Packaging: Cut Tape; ComponentLink2URL: http://industrial.panasonic.com/cdbs/www-data/pdf/RDA0000/AOA0000C86.pdf
R60 = CMP-2100-03667-1: Chip Resistor, 0 Ohm, +/- 5%, 0.1 W, -55 to 155 degC, 0603 (1608 Metric), RoHS, Tape and Reel; Manufacturer: Yageo; Temperature Coefficient: 200ppm/degreesC; Voltage Rating: 50V; Power Rating: 100mW; Resistance: 0mOhm; Width: 0.8mm; Max Operating Temperature: 155degC; Tolerance: 5%; Package Reference: 0603; Height: 0.45mm; Depth: 0.8mm; Package Description: 2-Pin Surface Mount Device, Body 1.6 x 0.8 mm; Termination: SMD/SMT; Package Quantity: 5000; Case/Package: 0603; Case Code (Imperial): 0603; Radiation Hardening: No; Number of Pins: 2; Length: 1.6mm; Lead Free: LeadFree; Voltage Rating (DC): 50V; Military Standard: Not; Datasheet URL: http://www.yageo.com/NewPortal/yageodocoutput?fileName=/pdf/R-Chip/PYu-RC_Group_51_RoHS_L_5.pdf; Manufacturer URL: http://www.yageo.com/; Packaging: TapeandReel; Case Code (Metric): 1608; Min Operating Temperature: -55degC; Composition: ThickFilm; RoHSCompliant: true; Contact Plating: Tin; Datasheet Version: Rev. 5, 10/2016; REACH SVHC: NoSVHC
R64 = CMP-2002-08356-2: RES Thick Film, 20kΩ, 1%, 0.063W, 100ppm/°C, 0402; Max Power Dissipation: 63mW; Working Voltage: 50V; Resistance: 20kR; Contact Plating: Tin; Packaging: Tape and Reel; Height: 0.35mm; Case Code (Imperial): 0402; Tolerance: 1%; Width: 0.5mm; Composition: Thick Film; Mount: Surface Mount; Termination: SMD/SMT; Number of Pins: 2; Number of Terminations: 2; Length: 1mm; Temperature Coefficient: 100ppm/°C; Case Code (Metric): 1005; Voltage Rating: 50V; Lead Free: Lead Free; Voltage Rating (DC): 50V; Min Operating Temperature: -55°C; Max Operating Temperature: 155°C; Package Quantity: 10; Radiation Hardening: No; Weight: 2.3E-05oz; Military Standard: Not; Case/Package: 0402; Power Rating: 63mW; Depth: 0.5mm; Features: Automotive AEC-Q200
R65 = CMP-2002-08135-2: RES SMD 10K OHM 1% 1/16W 0402; Power Rating: 63mW; Resistance: 10kR; Voltage Rating: 50V; Temperature Coefficient: 100ppm/°C; Case Code (Metric): 1005; Features: Automotive AEC-Q200; Termination: SMD/SMT; Mount: Surface Mount; Package Quantity: 10; Packaging: Tape and Reel; Case Code (Imperial): 0402; Weight: 2.3E-05oz; Lead Free: Lead Free; Width: 0.02inch; Max Power Dissipation: 63mW; Tolerance: 1%; Number of Terminations: 2; Height: 0.35mm; Number of Pins: 2; Composition: Thick Film; Length: 1mm; Voltage Rating (DC): 50V; Case/Package: 0402; Radiation Hardening: No; Contact Plating: Tin; Depth: 0.5mm; Military Standard: Not; Min Operating Temperature: -55°C; Max Operating Temperature: 155°C
R66 = CMP-2002-00957-2: RES SMD 47.5K OHM 1% 1/10W 0402; Voltage Rating: 50V; Max Power Dissipation: 100mW; Temperature Coefficient: 100ppm/°C; Resistance: 47.5kR; Packaging: Tape and Reel; Height: 0.35mm; Resistor Type: Thick Film; Width: 0.02inch; Case Code (Imperial): 0402; Voltage Rating (DC): 50V; Package Quantity: 1; Construction: Rectangular; Termination: SMD/SMT; Min Operating Temperature: -55°C; Case Code (Metric): 1005; Features: Automotive AEC-Q200; Length: 1mm; Number of Terminations: 2; Resistance Tolerance: 1%; Power Rating: 100mW; Size Code: 0402; Contact Plating: Tin; RoHS Compliant: Yes; REACH SVHC: No SVHC; Max Operating Temperature: 155°C; Depth: 0.5mm; Technology: THICK FILM; Tolerance: 1%; Mount: Surface Mount; Series: ERJ; Military Standard: Not; Lead Free: Lead Free; Case/Package: 0402
R68 = CMP-2004-02509-1: Manufacturer: Multicomp; Part Number: MCRE000141
R69 = CMP-2001-00784-1: Manufacturer: Panasonic; Part Number: ERA6AEB2551V
R70 = CMP-2002-07038-1: Manufacturer: Yageo / Phycomp; Part Number: RC0402FR-0716KL
R71 = CMP-1011-00207-2: RES Thick Film, 2.2Ω, 1%, 0.063W, 100ppm/°C, 0402; Voltage Rating: 50V; Resistance: 2.2R; Max Power Dissipation: 63mW; Weight: 2.3E-05oz; Max Operating Temperature: 155°C; Number of Terminations: 2; Depth: 0.5mm; Voltage Rating (DC): 50V; Case/Package: 0402; Height: 0.35mm; Lead Free: Lead Free; Width: 0.5mm; Package Quantity: 10; Termination: SMD/SMT; Number of Pins: 2; Case Code (Metric): 1005; Composition: Thick Film; Packaging: Tape and Reel; Temperature Coefficient: 100ppm/°C; Case Code (Imperial): 0402; Radiation Hardening: No; Features: Automotive AEC-Q200; Military Standard: Not; Contact Plating: Tin; Tolerance: 1%; Power Rating: 63mW; Length: 1mm; Min Operating Temperature: -55°C
R72-R75 = CMP-2002-07697-1: Part Number: RC0402FR-07470RL; Manufacturer: Yageo / Phycomp
U2 = ADP5138ACPZ: No Description Available; Copyright: Copyright (C) 2021 Accelerated Designs. All rights reserved; RefDes: RefDes; Type: Type
U8 = CMP-06317-000033-1: IC CURRENT SENSE MON SGL 10VDFN; Common Mode Rejection Ratio: 80dB; Quiescent Current: 360uA; Max Supply Current: 900uA; Output Type: Digital; Max Supply Voltage: 5.5V; Min Supply Voltage: 3V; Accuracy: 1%; Height: 0.85mm; Length: 3.1mm; REACH SVHC: No SVHC; Supply Current: 360uA; Width: 3.1mm; Nominal Supply Current: 360uA; Max Operating Temperature: 85°C; Case/Package: DFN; Radiation Hardening: No; Packaging: Tape and Reel; Package Quantity: 4000; RoHS Compliant: Yes; Min Operating Temperature: -40°C; Number of Pins: 10; Mount: Surface Mount; Series: -
U11 = MIC22705YML-TR: No Description Available; Mfr_Name: Microchip; RefDes: RefDes; Type: Type
R8 = RN73H1ETTP1452F25: Package: None; Price: None; Value: *; MP: RN73H1ETTP1452F25; Availability: Unavailable; Parameter 1: 14.5k; Parameter 2: 0402

## Sheet Power and Decoupling Capacitors.SchDoc
size A2; SheetNumber: 3; SheetTotal: 8
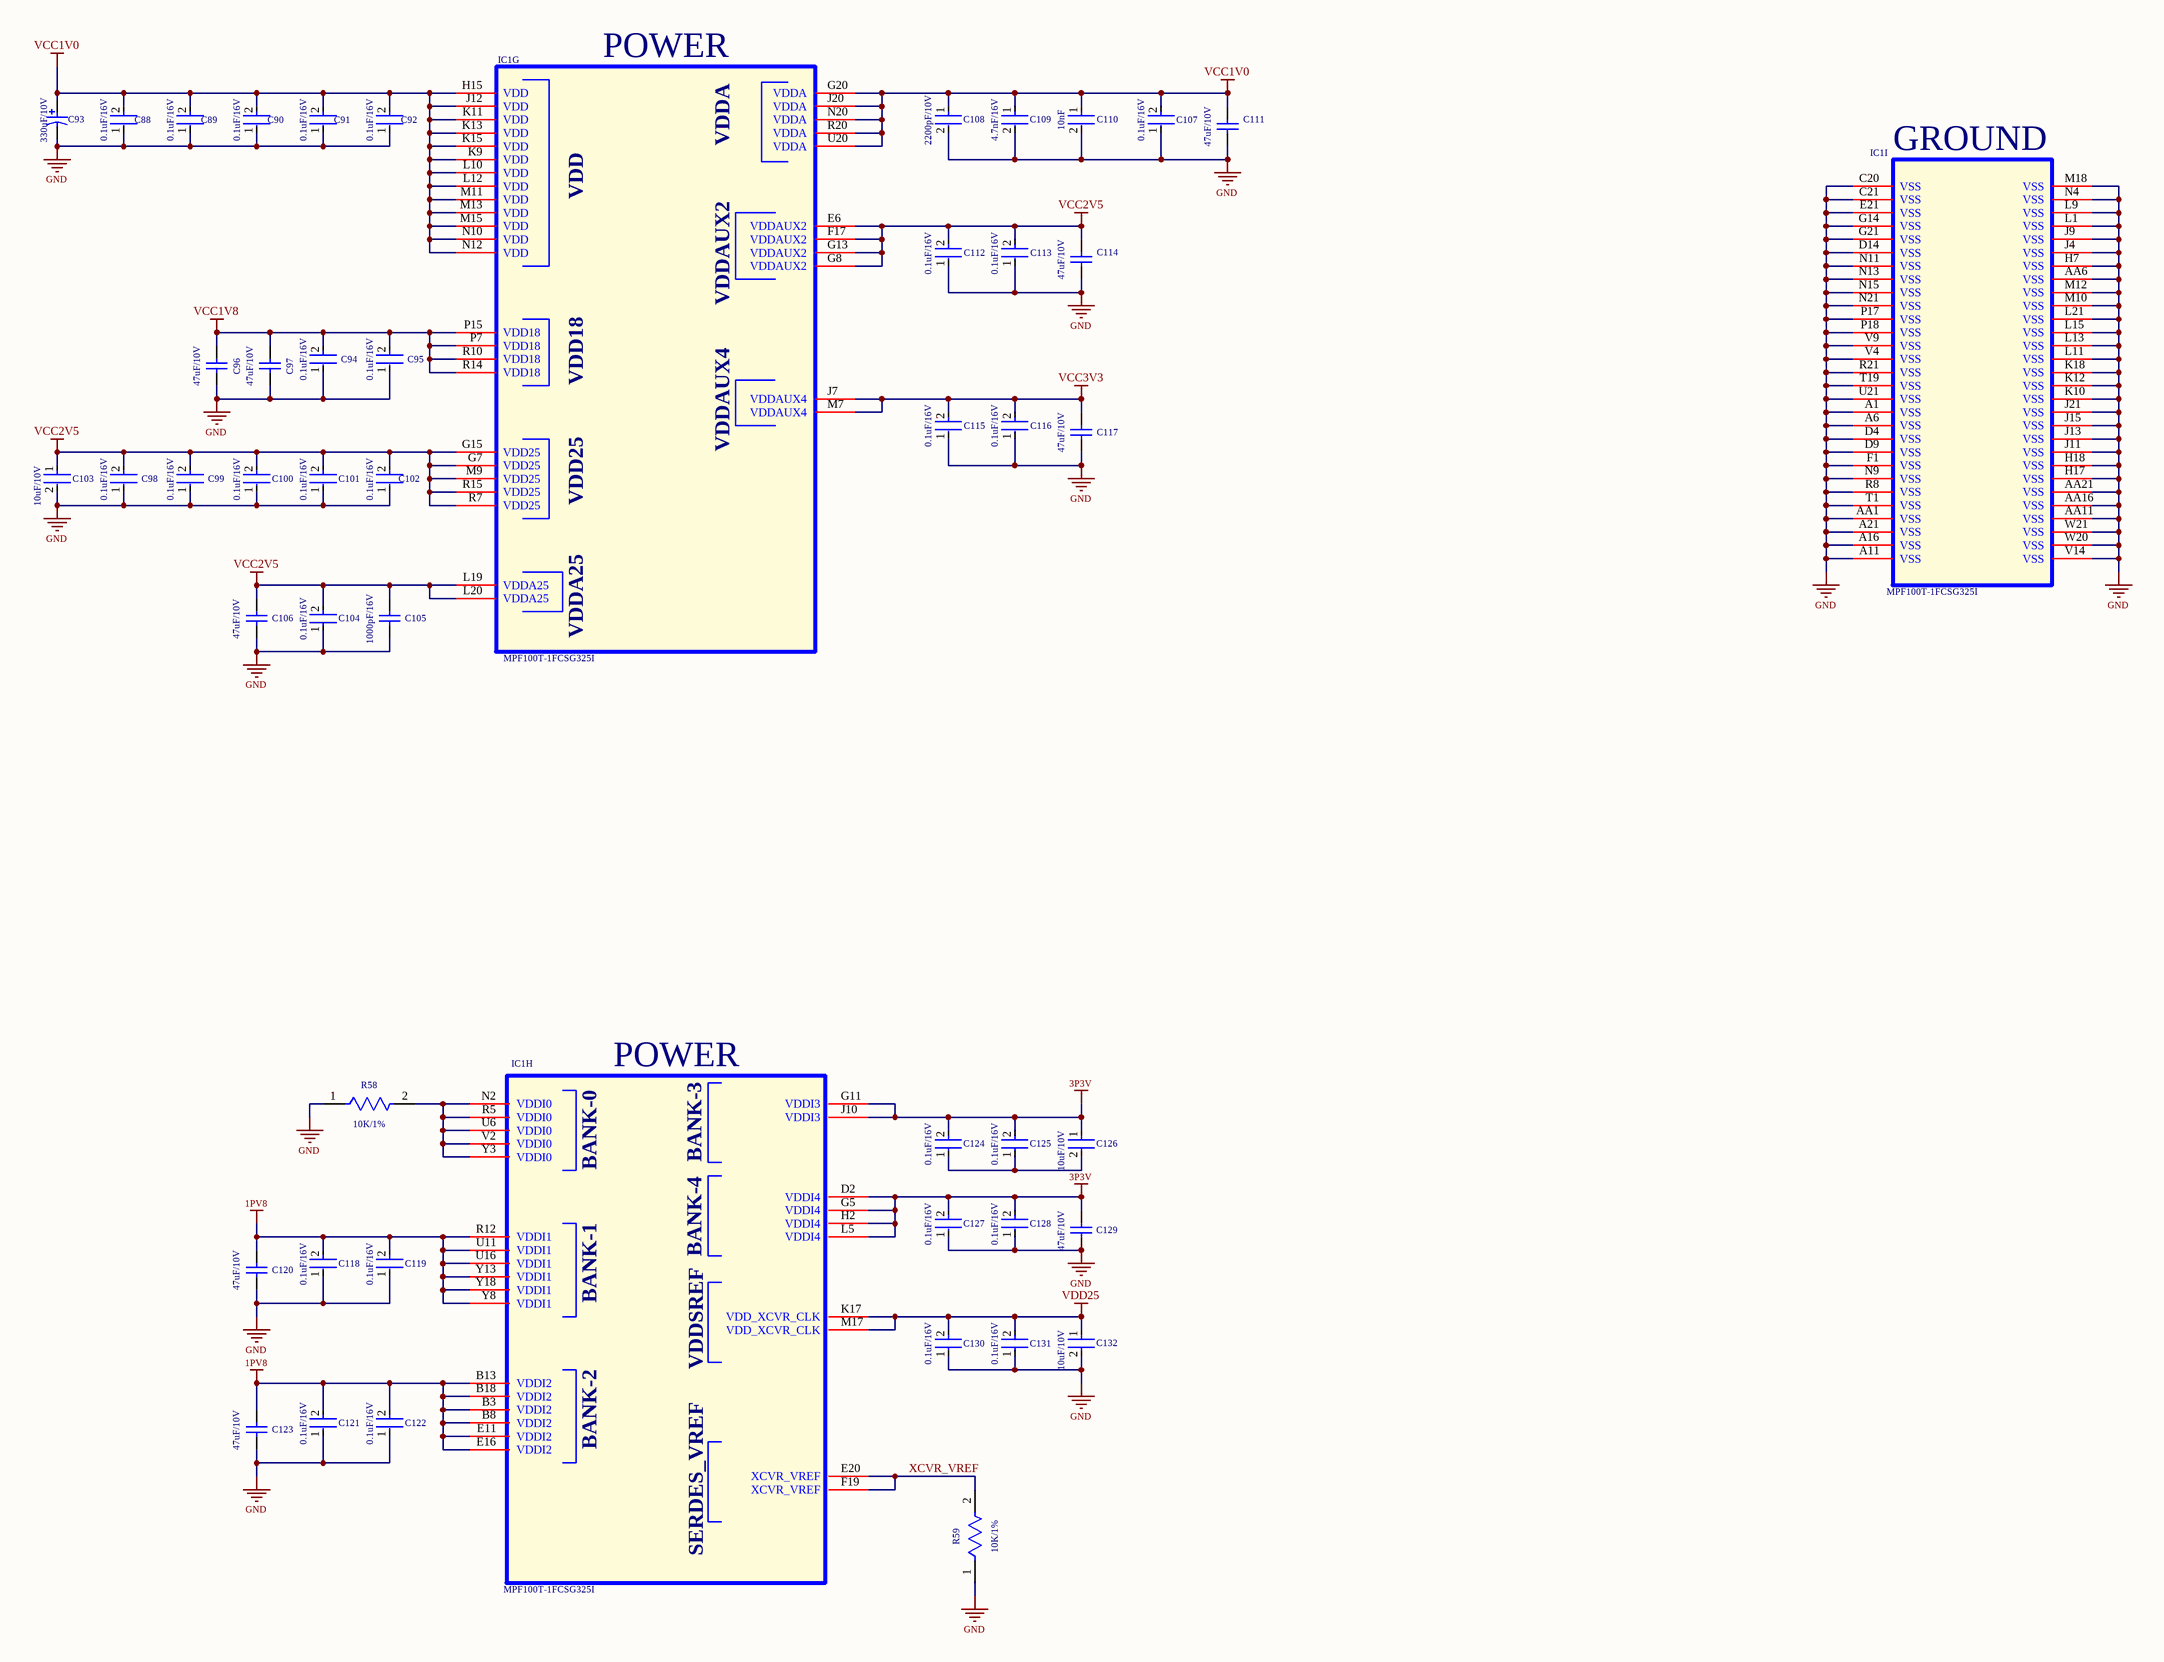
[diagram p2: Power and Decoupling Capacitors.SchDoc]

### Parts
C88  0.1uF/16V  [FP-GRM15-MFG]
C89  0.1uF/16V  [FP-GRM15-MFG]
C90  0.1uF/16V  [FP-GRM15-MFG]
C91  0.1uF/16V  [FP-GRM15-MFG]
C92  0.1uF/16V  [FP-GRM15-MFG]
C93  330uF/10V  [NIC-CAPA2-8X10_V]
C94  0.1uF/16V  [FP-GRM15-MFG]
C95  0.1uF/16V  [FP-GRM15-MFG]
C96  47uF/10V  [CAPC2014X135X70LL20]
C97  47uF/10V  [CAPC2014X135X70LL20]
C98  0.1uF/16V  [FP-GRM15-MFG]
C99  0.1uF/16V  [FP-GRM15-MFG]
C100  0.1uF/16V  [FP-GRM15-MFG]
C101  0.1uF/16V  [FP-GRM15-MFG]
C102  0.1uF/16V  [FP-GRM15-MFG]
C103  10uF/10V  [FP-CL05A106MP5NUNC-MFG]
C104  0.1uF/16V  [FP-GRM15-MFG]
C105  1000pF/16V  [CAPC0603X33X15LL03T05]
C106  47uF/10V  [CAPC2014X135X70LL20]
C107  0.1uF/16V  [FP-GRM15-MFG]
C108  2200pF/10V  [FP-C0402-BB-MFG]
C109  4.7nF/16V  [FP-CC0201-BA-MFG]
C110  10nF  [FP-0402-L_1_0_1-W_0_5_0_1-IPC_B]
C111  47uF/10V  [CAPC2014X135X70LL20]
C112  0.1uF/16V  [FP-GRM15-MFG]
C113  0.1uF/16V  [FP-GRM15-MFG]
C114  47uF/10V  [CAPC2014X135X70LL20]
C115  0.1uF/16V  [FP-GRM15-MFG]
C116  0.1uF/16V  [FP-GRM15-MFG]
C117  47uF/10V  [CAPC2014X135X70LL20]
C118  0.1uF/16V  [FP-GRM15-MFG]
C119  0.1uF/16V  [FP-GRM15-MFG]
C120  47uF/10V  [CAPC2014X135X70LL20]
C121  0.1uF/16V  [FP-GRM15-MFG]
C122  0.1uF/16V  [FP-GRM15-MFG]
C123  47uF/10V  [CAPC2014X135X70LL20]
C124  0.1uF/16V  [FP-GRM15-MFG]
C125  0.1uF/16V  [FP-GRM15-MFG]
C126  10uF/10V  [FP-CL05A106MP5NUNC-MFG]
C127  0.1uF/16V  [FP-GRM15-MFG]
C128  0.1uF/16V  [FP-GRM15-MFG]
C129  47uF/10V  [CAPC2014X135X70LL20]
C130  0.1uF/16V  [FP-GRM15-MFG]
C131  0.1uF/16V  [FP-GRM15-MFG]
C132  10uF/10V  [FP-CL05A106MP5NUNC-MFG]
IC1  MPF100T-1FCSG325I  [MPF100T-1FCSG325I]  (parts G,H,I of 9)
R58  10K/1%  [FP-RC0603-0_55-IPC_C]
R59  10K/1%  [FP-RC0603-0_55-IPC_C]

### Nets
1PV8: C118.2 C119.2 C120.1 C121.2 C122.2 C123.1 IC1.B3(VDDI2) IC1.B8(VDDI2) IC1.B13(VDDI2) IC1.B18(VDDI2) IC1.E11(VDDI2) IC1.E16(VDDI2) IC1.R12(VDDI1) IC1.U11(VDDI1) IC1.U16(VDDI1) IC1.Y8(VDDI1) IC1.Y13(VDDI1) IC1.Y18(VDDI1)
3P3V: C124.2 C125.2 C126.1 C127.2 C128.2 C129.1 IC1.D2(VDDI4) IC1.G5(VDDI4) IC1.G11(VDDI3) IC1.H2(VDDI4) IC1.J10(VDDI3) IC1.L5(VDDI4)
GND: C88.1 C89.1 C90.1 C91.1 C92.1 C93.2 C94.1 C95.1 C96.2 C97.2 C98.1 C99.1 C100.1 C101.1 C102.1 C103.2 C104.1 C105.1 C106.2 C107.1 C108.2 C109.2 C110.2 C111.2 C112.1 C113.1 C114.2 C115.1 C116.1 C117.2 C118.1 C119.1 C120.2 C121.1 C122.1 C123.2 C127.1 C128.1 C129.2 C130.1 C131.1 C132.2 IC1.A1(VSS) IC1.A6(VSS) IC1.A11(VSS) IC1.A16(VSS) IC1.A21(VSS) IC1.AA1(VSS) IC1.AA6(VSS) IC1.AA11(VSS) IC1.AA16(VSS) IC1.AA21(VSS) IC1.C20(VSS) IC1.C21(VSS) IC1.D4(VSS) IC1.D9(VSS) IC1.D14(VSS) IC1.E21(VSS) IC1.F1(VSS) IC1.G14(VSS) IC1.G21(VSS) IC1.H7(VSS) IC1.H17(VSS) IC1.H18(VSS) IC1.J4(VSS) IC1.J9(VSS) IC1.J11(VSS) IC1.J13(VSS) IC1.J15(VSS) IC1.J21(VSS) IC1.K10(VSS) IC1.K12(VSS) IC1.K18(VSS) IC1.L1(VSS) IC1.L9(VSS) IC1.L11(VSS) IC1.L13(VSS) IC1.L15(VSS) IC1.L21(VSS) IC1.M10(VSS) IC1.M12(VSS) IC1.M18(VSS) IC1.N4(VSS) IC1.N9(VSS) IC1.N11(VSS) IC1.N13(VSS) IC1.N15(VSS) IC1.N21(VSS) IC1.P17(VSS) IC1.P18(VSS) IC1.R8(VSS) IC1.R21(VSS) IC1.T1(VSS) IC1.T19(VSS) IC1.U21(VSS) IC1.V4(VSS) IC1.V9(VSS) IC1.V14(VSS) IC1.W20(VSS) IC1.W21(VSS) R58.1 R59.1
VCC1V0: C88.2 C89.2 C90.2 C91.2 C92.2 C93.1 C107.2 C108.1 C109.1 C110.1 C111.1 IC1.G20(VDDA) IC1.H15(VDD) IC1.J12(VDD) IC1.J20(VDDA) IC1.K9(VDD) IC1.K11(VDD) IC1.K13(VDD) IC1.K15(VDD) IC1.L10(VDD) IC1.L12(VDD) IC1.M11(VDD) IC1.M13(VDD) IC1.M15(VDD) IC1.N10(VDD) IC1.N12(VDD) IC1.N20(VDDA) IC1.R20(VDDA) IC1.U20(VDDA)
VCC1V8: C94.2 C95.2 C96.1 C97.1 IC1.P7(VDD18) IC1.P15(VDD18) IC1.R10(VDD18) IC1.R14(VDD18)
VCC2V5: C98.2 C99.2 C100.2 C101.2 C102.2 C103.1 C104.2 C105.2 C106.1 C112.2 C113.2 C114.1 IC1.E6(VDDAUX2) IC1.F17(VDDAUX2) IC1.G7(VDD25) IC1.G8(VDDAUX2) IC1.G13(VDDAUX2) IC1.G15(VDD25) IC1.L19(VDDA25) IC1.L20(VDDA25) IC1.M9(VDD25) IC1.R7(VDD25) IC1.R15(VDD25)
VCC3V3: C115.2 C116.2 C117.1 IC1.J7(VDDAUX4) IC1.M7(VDDAUX4)
VDD25: C130.2 C131.2 C132.1 IC1.K17(VDD_XCVR_CLK) IC1.M17(VDD_XCVR_CLK)
XCVR_VREF: IC1.E20(XCVR_VREF) IC1.F19(XCVR_VREF) R59.2
NetC124_1: C124.1 C125.1 C126.2
NetIC1_N2: IC1.N2(VDDI0) IC1.R5(VDDI0) IC1.U6(VDDI0) IC1.V2(VDDI0) IC1.Y3(VDDI0) R58.2

### Notes on the sheet
- (in symbol MPF100T-1FCSG325I, part G) POWER
- (in symbol MPF100T-1FCSG325I, part H) POWER; BANK-3; BANK-0; BANK-4; BANK-1; VDDSREF; BANK-2; SERDES_VREF
- (in symbol MPF100T-1FCSG325I, part I) GROUND

### Library data of the parts
C88-C92 C94 C95 C98-C102 C104 C107 C112 C113 C115 C116 C118 C119 C121 C122 C124 C125 C127 C128 C130 C131 = CMP-2100-03641-2: as C135 on sheet PMIC; RoHS: TRUE; Temperature Characteristic: X7R; Octopart: https://octopart.com/grm155r71c104ka88d-murata-196880; Digikey Description: CAP CER 0.1UF 16V X7R 0402; Device Class L3: Ceramic Capacitors; Height: 0.55mm; ComponentLink2Description: Datasheet; Temperature Range Low: -55°C; Ipc Land Pattern Name: CAPC10050X219; ComponentLink2URL: https://search.murata.co.jp/Ceramy/image/img/A01X/G101/ENG/GRM155R71H471KA01-01A.pdf; Device Class L1: Passive Components; Lead Free: yes; Category: Cap; Package: GRM15; Temperature: -55°C to +125°C; Device Class L2: Capacitors; Temperature Range High: +125°C; Mouser Description: 0402 0.1 uF 16V ±10 % Tolerance X7R SMT Multilayer Ceramic Capacitor
C93 = CMP-0687-00065-1: Aluminum Electrolytic Capacitor, UD Series, Low Impedance, 330 uF, 16 V, + / - 20%, -55 to 105 degC, Chip Type, 8 x 10 mm D x L, Pb-Free, Reel; Manufacturer: Nichicon; PartNumber: UUD1C331MNL1GS; Rated Ripple Current (at 100kHz): 450 mA; Rated Voltage: 16 V; Packing: Dia382mm Reel; Rated Capacitance: 330 uF; Impedance: 0.17 Ohm; Tolerance Rated Capacitance: -20 to 20%; Endurance Time: 5000 h; ComponentLink1URL: http://www.nichicon.co.jp/; RoHS: TRUE; ComponentLink3Description: Package Specification; ComponentLink2URL: http://products.nichicon.co.jp/en/pdf/XJA043/e-ud.pdf; ComponentLink1Description: Manufacturer URL; DatasheetVersion: 08/2012; Length: 10 mm; Mounting Technology: Surface Mount; ComponentLink2Description: Datasheet; ComponentLink3URL: http://products.nichicon.co.jp/en/pdf/XJA043/e-ud.pdf; Diameter: 8 mm; PackageDescription: 2-Pin Surface Mount Device, Diameter 8 mm, Height 10 mm, Pitch 6.5 mm; PackageReference: CAPAE-D8H10
C96 C97 C106 C111 C114 C117 C120 C123 C129 = CMP-2007-00047-1: Part Number: TLCR476M010XTA; Manufacturer: AVX Interconnect / Elco
C103 C126 C132 = CMP-13271-000002-1: CAP CER 10UF 10V X5R 0402; Manufacturer Part Number: CL05A106MP5NUNC; Manufacturer: Samsung; Temperature Coefficient: 15%; Tolerance: 20%; Material: Ceramic; Octopart: https://octopart.com/cl05a106mp5nunc-samsung-22457395; Voltage Rating: 10V; RoHS: TRUE; Value: 10uF; Height: 0.7mm; Digikey Description: CAP CER 10UF 10V X5R 0402; Automotive: No; Package: CL05A106MP5NUNC; Device Class L1: Passive Components; Capacitance: 10uF; Temperature Range High: +85°C; ComponentLink2Description: Datasheet; Device Class L2: Capacitors; Temperature Characteristic: X5R; Temperature: -55°C to +85°C; ComponentLink2URL: http://www.samsungsem.com/kr/support/product-search/mlcc/__icsFiles/afieldfile/2019/05/10/19-CL05A106MP5NUNC.pdf; Device Class L3: Ceramic Capacitors; Category: Cap; Temperature Range Low: -55°C; Ipc Land Pattern Name: CAPC10050X50; Lead Free: Yes
C105 = CMP-1033-00594-2: Part Number: 02013D102KAT2A; Manufacturer: AVX Interconnect / Elco
C108 = CMP-2008-03290-2: CAP CER 2200PF 25V 5% NP0 0402; Manufacturer: Kemet; Manufacturer Part Number: C0402C222J3GACTU; Temperature Characteristic: C0G; Temperature Coefficient: 15%; Value: 2,200 pF; Material: Ceramic; Tolerance: 0.05; Temperature: -55°C to +125°C; ComponentLink2URL: https://content.kemet.com/datasheets/KEM_C1002_X7R_SMD.pdf; Octopart: https://octopart.com/c0402c222j3gactu-kemet-9145102; Ipc Land Pattern Name: CAPC10050X50; RoHS: TRUE; Temperature Range High: +125°C; Device Class L3: Ceramic Capacitors; Device Class L1: Passive Components; Digikey Description: CAP CER 2200PF 25V 5% NP0 0402; Capacitance: 2,200 pF; Voltage Rating: 25 V; Automotive: No; Lead Free: Yes; ComponentLink2Description: Datasheet; Package: C0402-BB; Temperature Range Low: -55°C; Device Class L2: Capacitors; Height: 0.55mm; Category: Cap; Mouser Description: Multilayer Ceramic Capacitors MLCC - SMD/SMT 25V 0.0022uF 5% C0G
C109 = CMP-03422-000880-1: CAP CER 4700PF 16V X7R 0201; Manufacturer Part Number: CC0201KRX7R7BB472; Manufacturer: Yageo; Value: 4.7 nF; Material: Ceramic; Temperature Coefficient: 15%; Tolerance: 0.1; Ipc Land Pattern Name: CAPC6030X30; Automotive: No; Lead Free: Yes; Digikey Description: CAP CER 4700PF 16V X7R 0201; Height: 0.33mm; Temperature Characteristic: X7R; ComponentLink2Description: Datasheet; Temperature: -55°C to +85°C; Octopart: https://octopart.com/cc0201krx7r7bb472-yageo-33242265; ComponentLink2URL: http://www.yageo.com/documents/recent/UPY-GPHC_X5R_4V-to-50V_25.pdf; Temperature Range Low: -55°C; Footprint Url: http://www.yageo.com/exep/pages/download/literatures/UPY-C_GEN_24.pdf; RoHS: TRUE; Temperature Range High: +85°C; Device Class L2: Capacitors; Category: Cap; Voltage Rating: 16 V; Mouser Description: Multilayer Ceramic Capacitors MLCC - SMD/SMT 4.7nF 16V X7R 10%; Device Class L1: Passive Components; Device Class L3: Ceramic Capacitors; Package: CC0201-BA; Capacitance: 4.7 nF
C110 = CMP-2008-02796-2: General Purpose Ceramic Capacitor, 0402, 10nF, 5%, X7R, 15%, 16V; Construction: Flat; Case Code (Metric): 1005; Lead Free: Lead Free; Radiation Hardening: No; REACH SVHC: No SVHC; Max Operating Temperature: 125°C; Case/Package: 0402; Dielectric: X7R; Case Code (Imperial): 0402; Length: 1mm; Width: 0.5mm; Capacitance: 10nF; Packaging: Tape and Reel; Depth: 0.5mm; Voltage: 16V; Termination: SMD/SMT; Contact Plating: Tin; Min Operating Temperature: -55°C; Mount: Surface Mount; Tolerance: 5%; Series: -; RoHS Compliant: Yes; Package Quantity: 10000; Thickness: 0.022inch; Height: 0.5mm; Voltage Rating (DC): 16V; Voltage Rating: 16V
IC1 = MPF100T-1FCSG325I: as IC1 on sheet Connector; ComponentLink1Description: Datasheet
R58 R59 = CMP-2100-03664-2: RES 10K OHM 1% 1/10W 0603; Voltage Rating: 75V; Voltage Rating (DC): 50V; Resistance: 10kR; Power Rating: 100mW; Temperature Coefficient: 100ppm/°C; Depth: 0.8mm; Termination: SMD/SMT; Resistor Type: Thick Film; Series: RC; Construction: Rectangular; Features: Moisture Resistant; Packaging: Tape and Reel; Min Operating Temperature: -55°C; Number of Terminations: 2; Lead Pitch: 0.3mm; RoHS Compliant: Yes; Case/Package: 0603; Resistance Tolerance: 1%; Military Standard: Not; Weight: 7.1E-05oz; Number of Pins: 2; Tolerance: 1%; Length: 1.6mm; Case Code (Imperial): 0603; Lead Free: Lead Free; Width: 0.8mm; Max Power Dissipation: 100mW; Height: 0.45mm; Max Operating Temperature: 155°C; Case Code (Metric): 1608; Size Code: 0603

## Sheet DRAM+BANK1.SchDoc
size A2; SheetNumber: 4; SheetTotal: 8
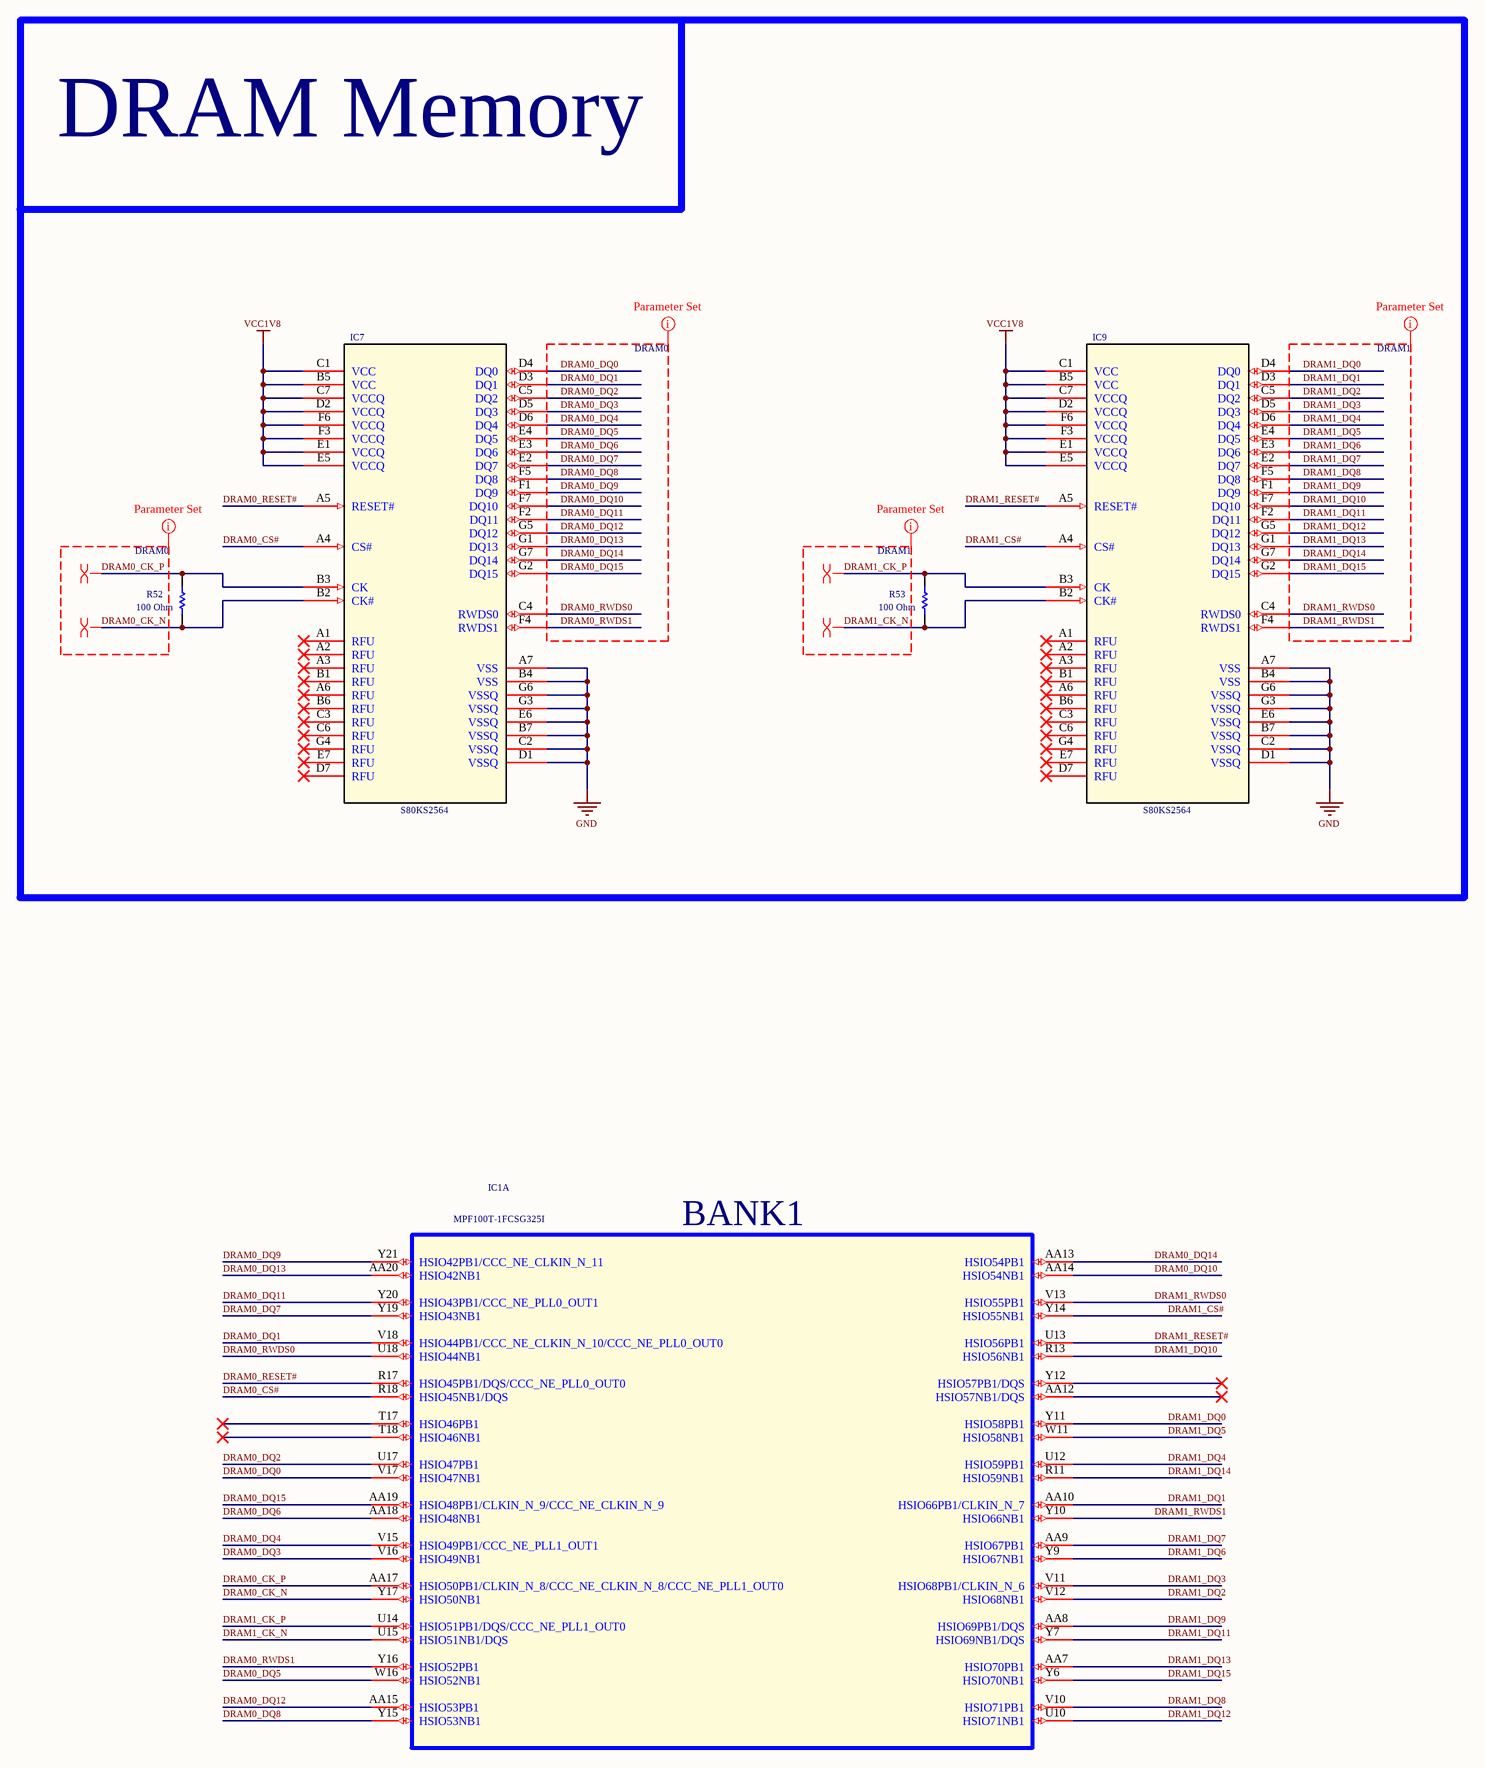
[diagram p3: DRAM+BANK1.SchDoc]

### Parts
IC1  MPF100T-1FCSG325I  [MPF100T-1FCSG325I]  (part A of 9)
IC7  S80KS2564  [S80KS2564]
IC9  S80KS2564  [S80KS2564]
R52  100 Ohm  [RESC1608X55X30LL15T15]
R53  100 Ohm  [RESC1608X55X30LL15T15]

### Blocks framed on the sheet
DRAM Memory: IC7 IC9 R52 R53

### Nets
GND: IC7.A7(VSS) IC7.B4(VSS) IC7.B7(VSSQ) IC7.C2(VSSQ) IC7.D1(VSSQ) IC7.E6(VSSQ) IC7.G3(VSSQ) IC7.G6(VSSQ) IC9.A7(VSS) IC9.B4(VSS) IC9.B7(VSSQ) IC9.C2(VSSQ) IC9.D1(VSSQ) IC9.E6(VSSQ) IC9.G3(VSSQ) IC9.G6(VSSQ)
VCC1V8: IC7.B5(VCC) IC7.C1(VCC) IC7.C7(VCCQ) IC7.D2(VCCQ) IC7.E1(VCCQ) IC7.E5(VCCQ) IC7.F3(VCCQ) IC7.F6(VCCQ) IC9.B5(VCC) IC9.C1(VCC) IC9.C7(VCCQ) IC9.D2(VCCQ) IC9.E1(VCCQ) IC9.E5(VCCQ) IC9.F3(VCCQ) IC9.F6(VCCQ)
DRAM0_CK_N: IC1.Y17(HSIO50NB1) IC7.B2(CK#) R52.1
DRAM0_CK_P: IC1.AA17(HSIO50PB1/CLKIN_N_8/CCC_NE_CLKIN_N_8/CCC_NE_PLL1_OUT0) IC7.B3(CK) R52.2
DRAM0_CS#: IC1.R18(HSIO45NB1/DQS) IC7.A4(CS#)
DRAM0_DQ0: IC1.V17(HSIO47NB1) IC7.D4(DQ0)
DRAM0_DQ1: IC1.V18(HSIO44PB1/CCC_NE_CLKIN_N_10/CCC_NE_PLL0_OUT0) IC7.D3(DQ1)
DRAM0_DQ2: IC1.U17(HSIO47PB1) IC7.C5(DQ2)
DRAM0_DQ3: IC1.V16(HSIO49NB1) IC7.D5(DQ3)
DRAM0_DQ4: IC1.V15(HSIO49PB1/CCC_NE_PLL1_OUT1) IC7.D6(DQ4)
DRAM0_DQ5: IC1.W16(HSIO52NB1) IC7.E4(DQ5)
DRAM0_DQ6: IC1.AA18(HSIO48NB1) IC7.E3(DQ6)
DRAM0_DQ7: IC1.Y19(HSIO43NB1) IC7.E2(DQ7)
DRAM0_DQ8: IC1.Y15(HSIO53NB1) IC7.F5(DQ8)
DRAM0_DQ9: IC1.Y21(HSIO42PB1/CCC_NE_CLKIN_N_11) IC7.F1(DQ9)
DRAM0_DQ10: IC1.AA14(HSIO54NB1) IC7.F7(DQ10)
DRAM0_DQ11: IC1.Y20(HSIO43PB1/CCC_NE_PLL0_OUT1) IC7.F2(DQ11)
DRAM0_DQ12: IC1.AA15(HSIO53PB1) IC7.G5(DQ12)
DRAM0_DQ13: IC1.AA20(HSIO42NB1) IC7.G1(DQ13)
DRAM0_DQ14: IC1.AA13(HSIO54PB1) IC7.G7(DQ14)
DRAM0_DQ15: IC1.AA19(HSIO48PB1/CLKIN_N_9/CCC_NE_CLKIN_N_9) IC7.G2(DQ15)
DRAM0_RESET#: IC1.R17(HSIO45PB1/DQS/CCC_NE_PLL0_OUT0) IC7.A5(RESET#)
DRAM0_RWDS0: IC1.U18(HSIO44NB1) IC7.C4(RWDS0)
DRAM0_RWDS1: IC1.Y16(HSIO52PB1) IC7.F4(RWDS1)
DRAM1_CK_N: IC1.U15(HSIO51NB1/DQS) IC9.B2(CK#) R53.1
DRAM1_CK_P: IC1.U14(HSIO51PB1/DQS/CCC_NE_PLL1_OUT0) IC9.B3(CK) R53.2
DRAM1_CS#: IC1.Y14(HSIO55NB1) IC9.A4(CS#)
DRAM1_DQ0: IC1.Y11(HSIO58PB1) IC9.D4(DQ0)
DRAM1_DQ1: IC1.AA10(HSIO66PB1/CLKIN_N_7) IC9.D3(DQ1)
DRAM1_DQ2: IC1.V12(HSIO68NB1) IC9.C5(DQ2)
DRAM1_DQ3: IC1.V11(HSIO68PB1/CLKIN_N_6) IC9.D5(DQ3)
DRAM1_DQ4: IC1.U12(HSIO59PB1) IC9.D6(DQ4)
DRAM1_DQ5: IC1.W11(HSIO58NB1) IC9.E4(DQ5)
DRAM1_DQ6: IC1.Y9(HSIO67NB1) IC9.E3(DQ6)
DRAM1_DQ7: IC1.AA9(HSIO67PB1) IC9.E2(DQ7)
DRAM1_DQ8: IC1.V10(HSIO71PB1) IC9.F5(DQ8)
DRAM1_DQ9: IC1.AA8(HSIO69PB1/DQS) IC9.F1(DQ9)
DRAM1_DQ10: IC1.R13(HSIO56NB1) IC9.F7(DQ10)
DRAM1_DQ11: IC1.Y7(HSIO69NB1/DQS) IC9.F2(DQ11)
DRAM1_DQ12: IC1.U10(HSIO71NB1) IC9.G5(DQ12)
DRAM1_DQ13: IC1.AA7(HSIO70PB1) IC9.G1(DQ13)
DRAM1_DQ14: IC1.R11(HSIO59NB1) IC9.G7(DQ14)
DRAM1_DQ15: IC1.Y6(HSIO70NB1) IC9.G2(DQ15)
DRAM1_RESET#: IC1.U13(HSIO56PB1) IC9.A5(RESET#)
DRAM1_RWDS0: IC1.V13(HSIO55PB1) IC9.C4(RWDS0)
DRAM1_RWDS1: IC1.Y10(HSIO66NB1) IC9.F4(RWDS1)

Not connected (* = marked no-connect by the designer): IC1 AA12(HSIO57NB1/DQS)* T17(HSIO46PB1)* T18(HSIO46NB1)* Y12(HSIO57PB1/DQS)*; IC7 A1(RFU)* A2(RFU)* A3(RFU)* A6(RFU)* B1(RFU)* B6(RFU)* C3(RFU)* C6(RFU)* D7(RFU)* E7(RFU)* G4(RFU)*; IC9 A1(RFU)* A2(RFU)* A3(RFU)* A6(RFU)* B1(RFU)* B6(RFU)* C3(RFU)* C6(RFU)* D7(RFU)* E7(RFU)* G4(RFU)*

### Layout directives
differential pair: DRAM0_CK_N, DRAM0_CK_P, DRAM1_CK_N, DRAM1_CK_P
net class DRAM0: DRAM0_CK_N, DRAM0_CK_P, DRAM0_DQ0, DRAM0_DQ1, DRAM0_DQ2, DRAM0_DQ3, DRAM0_DQ4, DRAM0_DQ5, DRAM0_DQ6, DRAM0_DQ7, DRAM0_DQ8, DRAM0_DQ9, DRAM0_DQ10, DRAM0_DQ11, DRAM0_DQ12, DRAM0_DQ13, DRAM0_DQ14, DRAM0_DQ15, DRAM0_RWDS0, DRAM0_RWDS1
net class DRAM1: DRAM1_CK_N, DRAM1_CK_P, DRAM1_DQ0, DRAM1_DQ1, DRAM1_DQ2, DRAM1_DQ3, DRAM1_DQ4, DRAM1_DQ5, DRAM1_DQ6, DRAM1_DQ7, DRAM1_DQ8, DRAM1_DQ9, DRAM1_DQ10, DRAM1_DQ11, DRAM1_DQ12, DRAM1_DQ13, DRAM1_DQ14, DRAM1_DQ15, DRAM1_RWDS0, DRAM1_RWDS1

### Notes on the sheet
- (in symbol MPF100T-1FCSG325I, part A) BANK1

### Library data of the parts
IC1 = MPF100T-1FCSG325I: as IC1 on sheet Connector; ComponentLink1Description: Datasheet
IC7 IC9 = S80KS2564: Jumper; Part_Number: J00001; ID: 110; Mounting_Type: SMT; Part_Name: Jumper; ComponentLink1Description: Datasheet
R52 R53 = CMP-2000-00179-1: Manufacturer: Panasonic; Part Number: ERJ-3EKF1000V; Manufacturer Part Number: ERJ3EKF1000V